# EAGLE board Dataforge-Pi (EAGLE 9.2.1), part 1 of 2
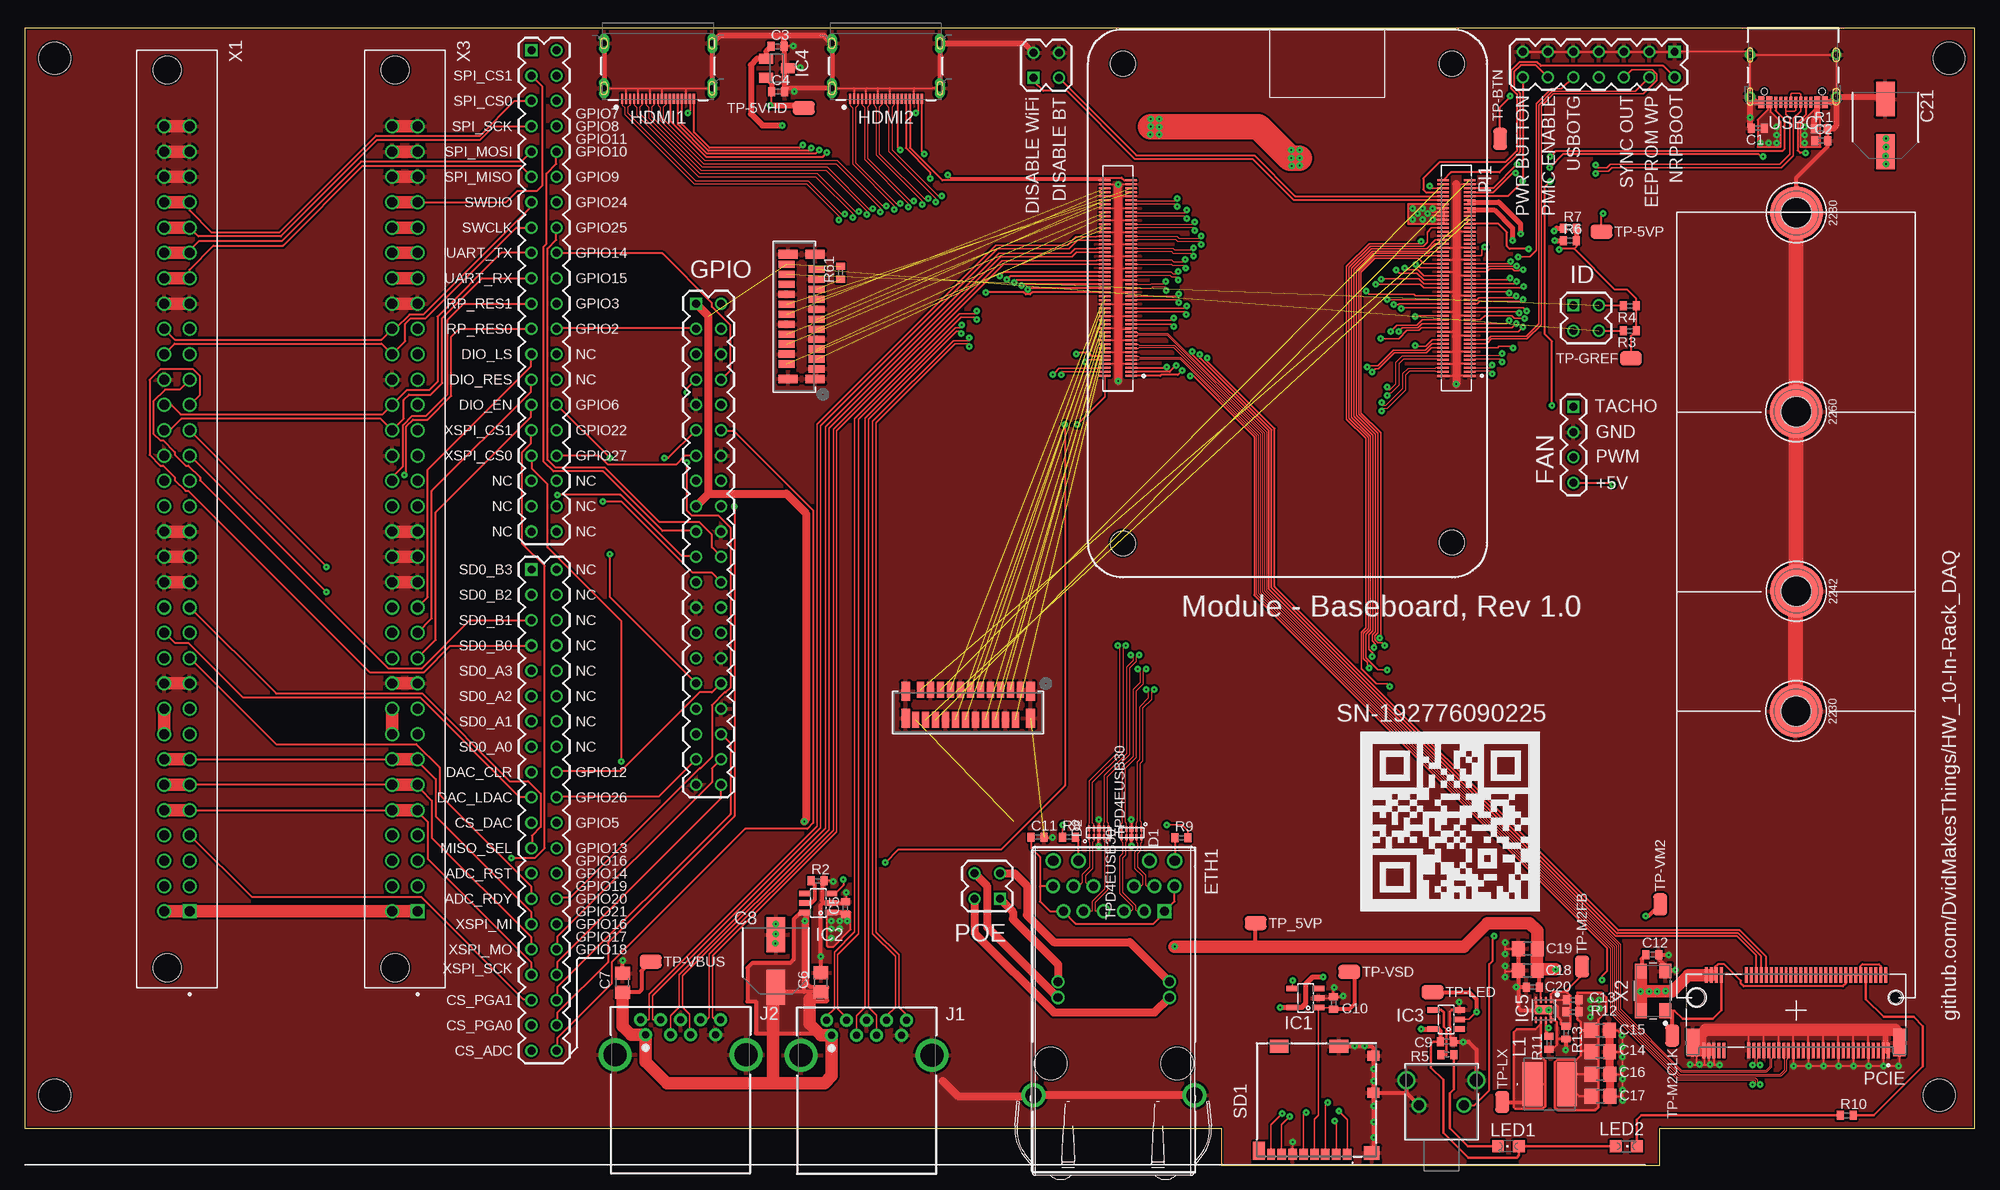
[diagram p5: board, top side]
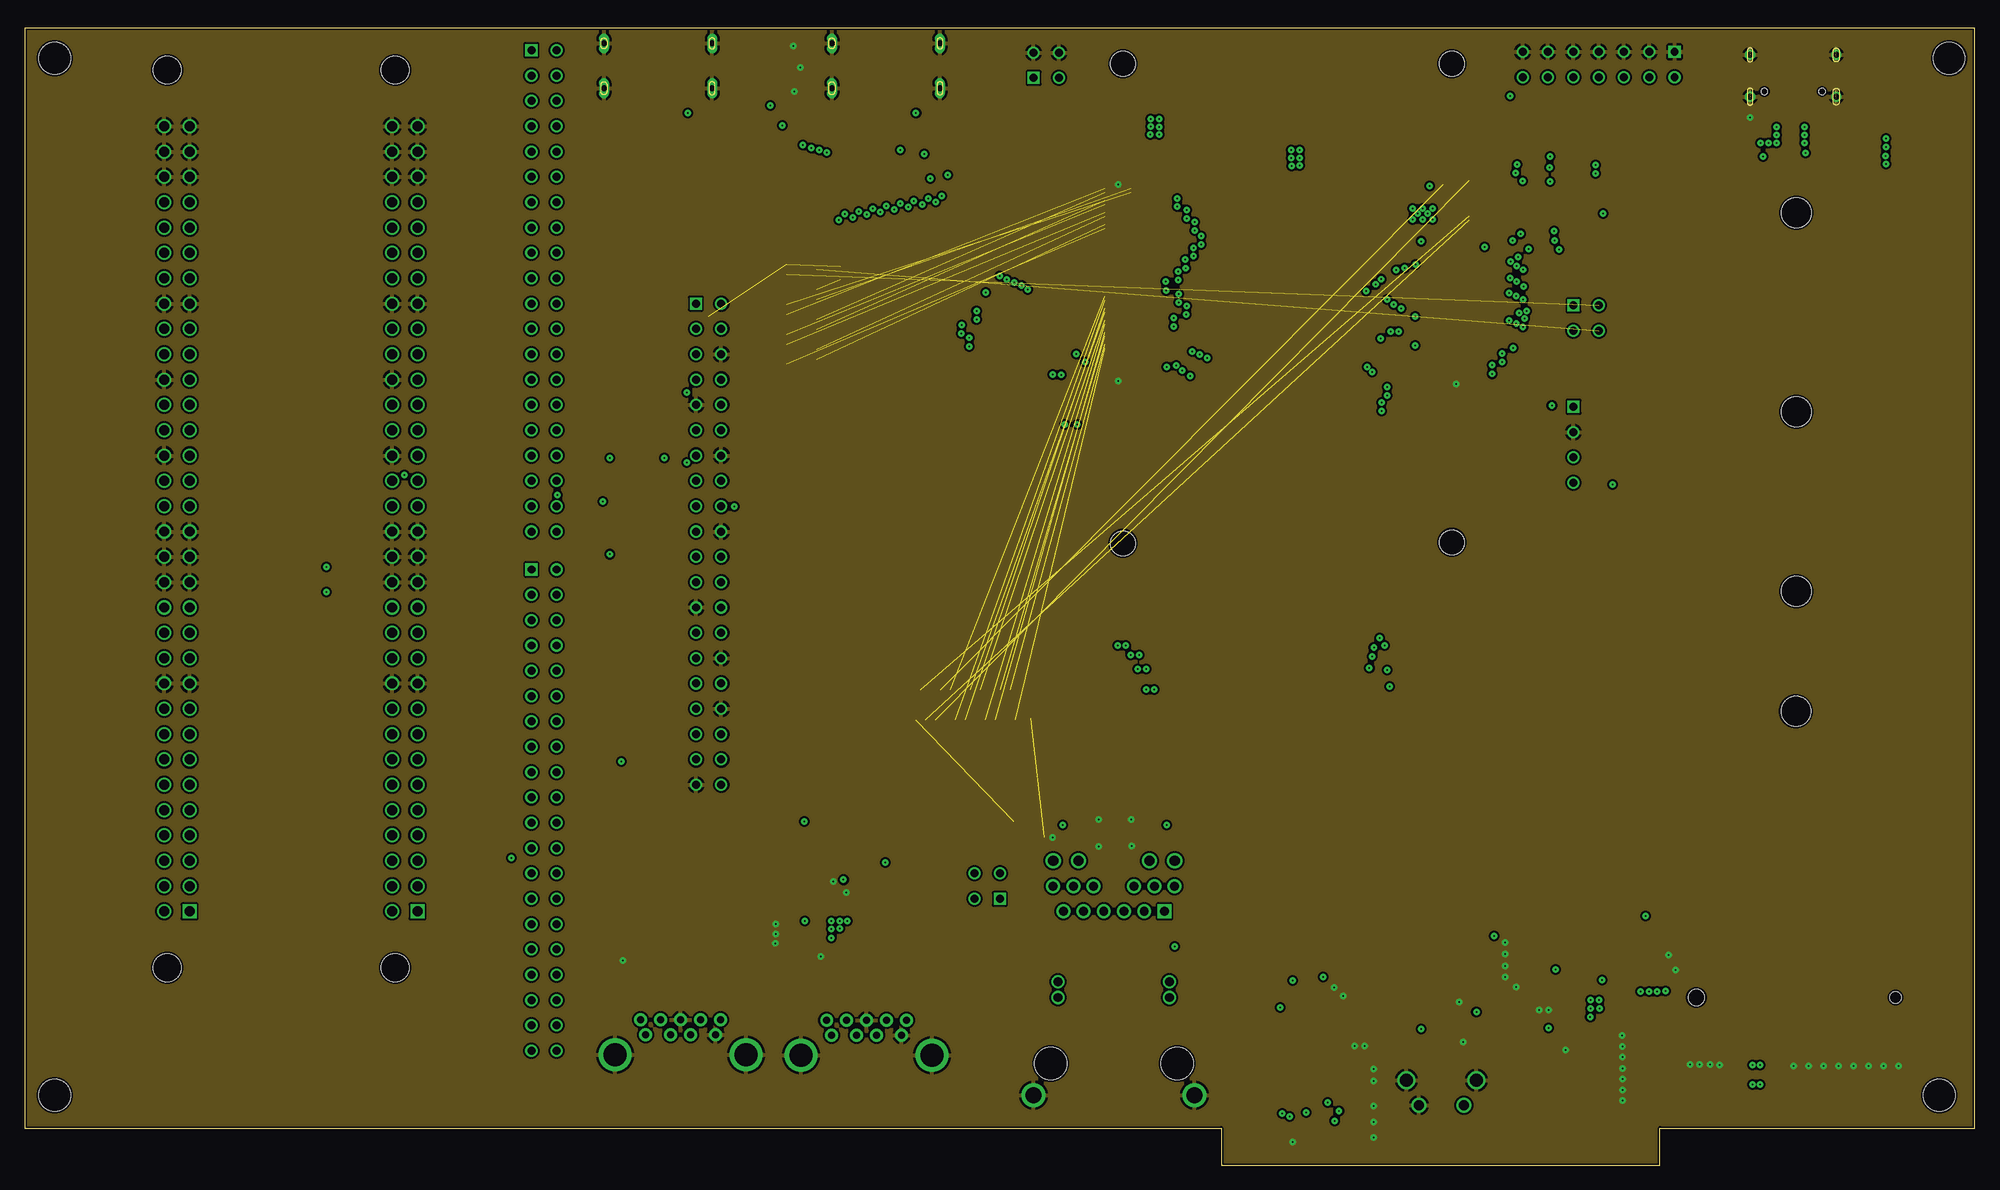
[diagram p6: board, inner layer Route2]
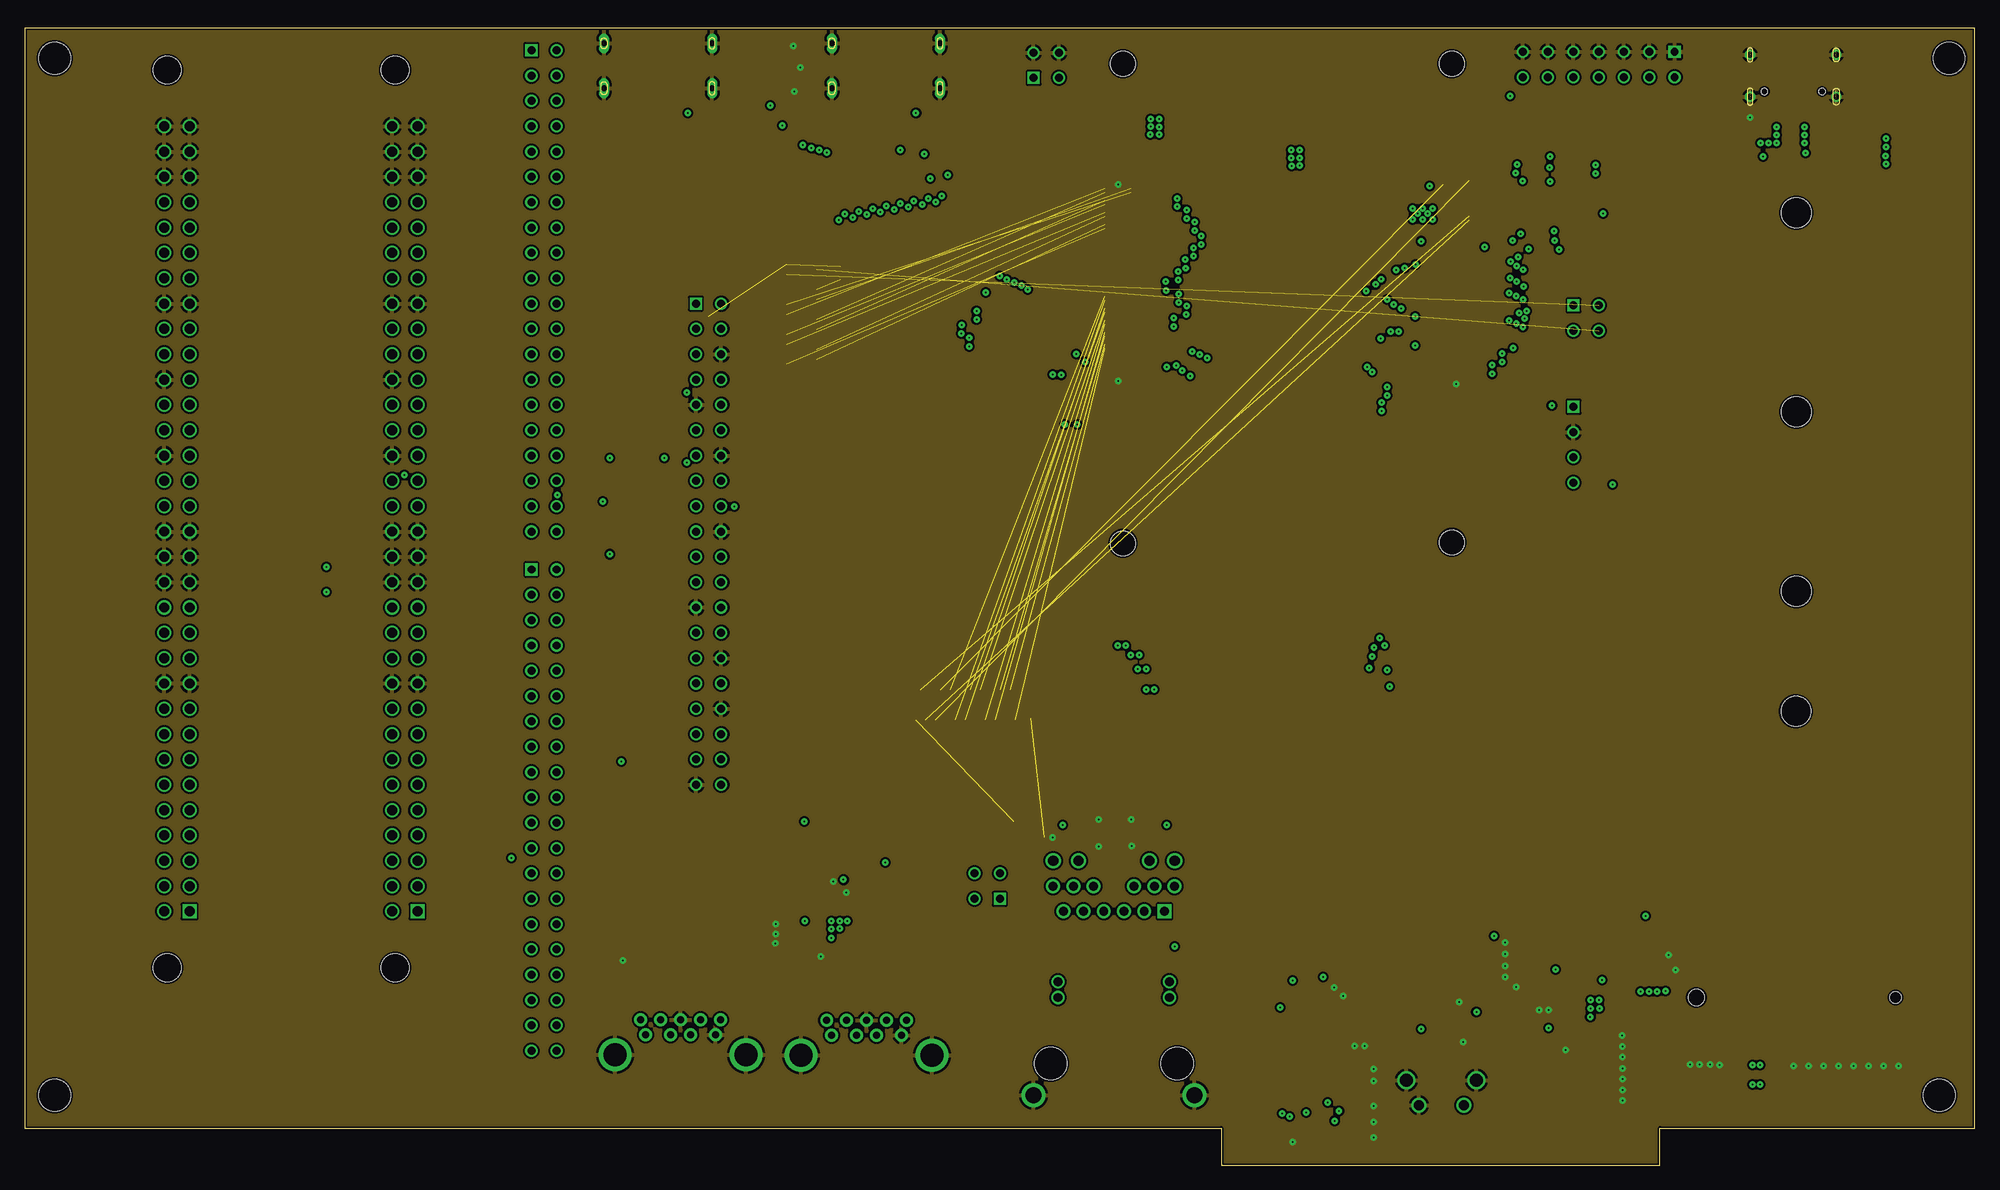
[diagram p7: board, inner layer Route15]
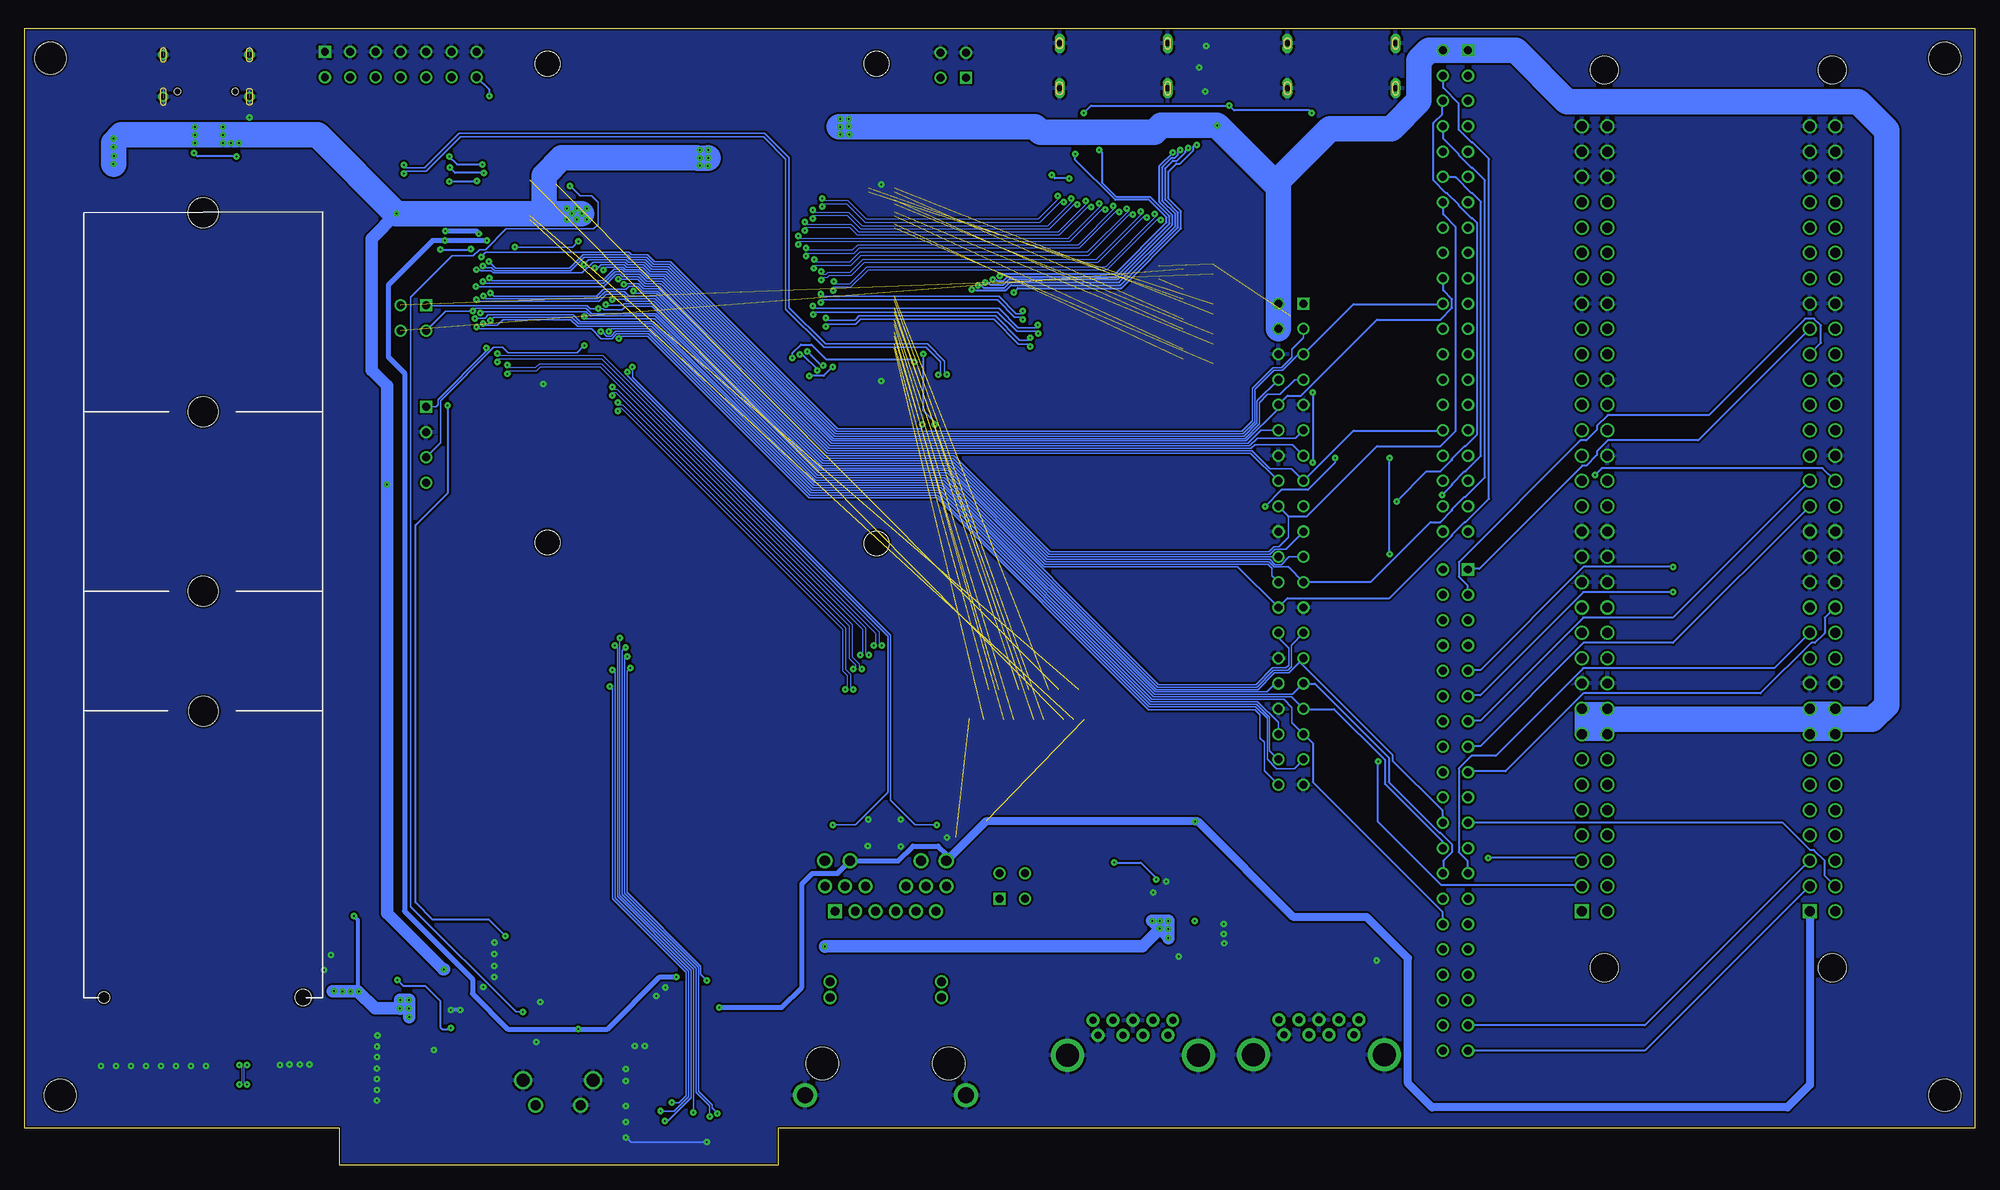
[diagram p8: board, bottom side, seen from below]

Size 195.56 x 114 mm. Coordinates in mm from the lower left corner, seen from the top.
Outline: 0,3.69 120,3.69 120,0 164,0 164,3.69 195.56,3.69 195.56,114 0,114 0,3.69
Copper layers (1+2*15+16): Top 0.035mm / dielectric 0.0994mm / Route2 0.0152mm / dielectric 1.265mm / Route15 0.0152mm / dielectric 0.0994mm / Bottom 0.035mm
Design rules "JLC04161H-3313": minimum track width 3.5mil, minimum drill 0.15mm, track to track 3.5mil, track to pad 3.5mil, pad to pad 3.5mil, via to via 3.5mil, smd to smd 3.5mil, copper to edge 0.2mm, drill to drill 6mil, minimum pad ring 8mil, minimum via ring 0.25mm, stop-mask expansion 0.05mm, vias tented up to drill 16mil, thermal gap 10mil
Net classes: 1 50R_DIFFPAIR: width 0.4 mm, drill 0.15 mm, clearance 0.191 mm; 2 90R_DIFFPAIR: width 0.155 mm, drill 0.15 mm, clearance 0.191 mm; 3 100R_DIFFPAIR: width 0.121 mm, drill 0.15 mm, clearance 0.191 mm
Holes 3.2 mm at 3,7 3,111 193,111 192,7

## Footprints (pad centres in the part's own frame; a part is rotated, then mirrored left to right if it is on the bottom)
WA-SMSI_9774010243 = smd 5.3 x 5.3: 1 0,0 | hole 3: 0,0
0402 = smd 0.7 x 0.9: 1 -0.65,0; 2 0.65,0
0805 = smd 1.3 x 1.5: 1 -0.95,0; 2 0.95,0
100UF-16V = smd 3.5 x 1.85: 1 -2.65,0; 2 2.65,0
2X20 = drill 0.8 square: 1 -1.27,24.13 | drill 0.8: 2 1.27,24.13; 3 -1.27,21.59; 4 1.27,21.59; 5 -1.27,19.05; 6 1.27,19.05; 7 -1.27,16.51; 8 1.27,16.51; 9 -1.27,13.97; 10 1.27,13.97; 11 -1.27,11.43; 12 1.27,11.43; 13 -1.27,8.89; 14 1.27,8.89; 15 -1.27,6.35; 16 1.27,6.35; 17 -1.27,3.81; 18 1.27,3.81; 19 -1.27,1.27; 20 1.27,1.27; 21 -1.27,-1.27; 22 1.27,-1.27; 23 -1.27,-3.81; 24 1.27,-3.81; 25 -1.27,-6.35; 26 1.27,-6.35; 27 -1.27,-8.89; 28 1.27,-8.89; 29 -1.27,-11.43; 30 1.27,-11.43; 31 -1.27,-13.97; 32 1.27,-13.97; 33 -1.27,-16.51; 34 1.27,-16.51; 35 -1.27,-19.05; 36 1.27,-19.05; 37 -1.27,-21.59; 38 1.27,-21.59; 39 -1.27,-24.13; 40 1.27,-24.13
USON = smd 0.57 x 0.2: 1 -0.4,1; 2 -0.4,0.5; 4 -0.4,-0.5; 5 -0.4,-1; 6 0.435,-1; 7 0.435,-0.5; 9 0.435,0.5; 10 0.435,1 | smd 0.57 x 0.4: 3 -0.4,0; 8 0.435,0
MAGJACK_POE = drill 1.02 pad 1.53: 17 6.11,15.24; 18 3.57,15.24; 19 -3.54,15.24; 20 -6.08,15.24 | drill 0.9 pad 1.4: CT1 -6.08,12.7; CT2 -5.07,10.16; CT4 6.1,12.7; TD1+ -4.05,12.7; TD1- -2.02,12.7; TD2+ -1.01,10.16; TD2- -3.04,10.16; TD3+ 1.02,10.16; TD3- 3.05,10.16; TD4+ 4.07,12.7; TD4- 2.04,12.7 | drill 0.9 pad 1.4 square: CT3 5.08,10.16 | drill 1.6 pad 2.4: MH3 -8.06,-8.25; MH4 8.08,-8.25 | drill 0.9 pad 1.25: VC1 5.6,3.1; VC2 -5.58,3.1; VC3 5.6,1.53; VC4 -5.58,1.53 | hole 3.25: -6.34,-5.08; 6.36,-5.08
1X4 = drill 0.8 square: 1 0,3.81 | drill 0.8: 2 0,1.27; 3 0,-1.27; 4 0,-3.81
685119136923 = smd 0.23 x 1: 1 3.6,1.05; 2 3.2,1.05; 3 2.8,1.05; 4 2.4,1.05; 5 2,1.05; 6 1.6,1.05; 7 1.2,1.05; 8 0.8,1.05; 9 0.4,1.05; 10 0,1.05; 11 -0.4,1.05; 12 -0.8,1.05; 13 -1.2,1.05; 14 -1.6,1.05; 15 -2,1.05; 16 -2.4,1.05; 17 -2.8,1.05; 18 -3.2,1.05; 19 -3.6,1.05 | drill 0.6 pad 0.9 long: S1 5.425,0; S2 -5.425,0 | drill 0.6 pad 0.8 long: S3 -5.425,-4.5; S4 5.425,-4.5
SOT23-5 = smd 0.55 x 1.2: 1 -0.95,-1.3; 2 0,-1.3; 3 0.95,-1.3; 4 0.95,1.3; 5 -0.95,1.3
SOT23-6 = smd 0.55 x 1.2: 1 -0.95,-1.3; 2 0,-1.3; 3 0.95,-1.3; 4 0.95,1.3; 5 0,1.3; 6 -0.95,1.3
SOT23 = smd 1 x 1.4: 1 -0.95,-1.1; 2 0.95,-1.1; 3 0,1.1
SON50P201X201X56-9T90X170N = smd 0.715 x 0.27: 1 -1.001,0.75; 2 -1.001,0.25; 3 -1.001,-0.25; 4 -1.001,-0.75; 5 1.001,-0.75; 6 1.001,-0.25; 7 1.001,0.25; 8 1.001,0.75 | smd 0.9 x 1.7: 9 0,0
2X2 = drill 0.8 square: 1 -1.27,1.27 | drill 0.8: 2 1.27,1.27; 3 -1.27,-1.27; 4 1.27,-1.27
692121030100 = drill 0.7 pad 1.3: 1 -3.5,5.36; 2 -1,5.36; 3 1,5.36; 4 3.5,5.36; 5 4,6.86; 6 2,6.86; 7 0,6.86; 8 -2,6.86; 9 -4,6.86 | drill 2.3 pad 3.3: S1 -6.57,3.36; S2 6.57,3.36
FH12-22S-0.5SH = smd 0.711 x 1.6: 1 5.251,2.244; 2 4.751,-0.756; 3 4.251,2.244; 4 3.751,-0.756; 5 3.251,2.244; 6 2.751,-0.756; 7 2.251,2.244; 8 1.75,-0.756; 9 1.25,2.244; 10 0.75,-0.756; 11 0.25,2.244; 12 -0.25,-0.756; 13 -0.75,2.244; 14 -1.25,-0.756; 15 -1.75,2.244; 16 -2.251,-0.756; 17 -2.751,2.244; 18 -3.251,-0.756; 19 -3.751,2.244; 20 -4.251,-0.756; 21 -4.751,2.244; 22 -5.251,-0.756 | smd 0.889 x 1.905: 23 -6.25,2.091; 24 6.25,2.091; 25 -6.25,-0.604; 26 6.25,-0.604
2X7 = drill 0.8 square: 1 -1.27,7.62 | drill 0.8: 2 1.27,7.62; 3 -1.27,5.08; 4 1.27,5.08; 5 -1.27,2.54; 6 1.27,2.54; 7 -1.27,0; 8 1.27,0; 9 -1.27,-2.54; 10 1.27,-2.54; 11 -1.27,-5.08; 12 1.27,-5.08; 13 -1.27,-7.62; 14 1.27,-7.62
SRR5228A = smd 4.4 x 2: 1 0,1.75; 2 0,-1.75
CHIPLED_0805 = smd 1.2 x 1.2: A 0,-1.05; C 0,1.05
M.2 = smd 0.3 x 1.55: 1 9.25,-4.005; 2 9,3.545; 3 8.75,-4.005; 4 8.5,3.545; 5 8.25,-4.005; 6 8,3.545; 7 7.75,-4.005; 8 7.5,3.545; 9 7.25,-4.005; 10 7,3.545; 11 6.75,-4.005; 12 6.5,3.545; 13 6.25,-4.005; 14 6,3.545; 15 5.75,-4.005; 16 5.5,3.545; 17 5.25,-4.005; 18 5,3.545; 19 4.75,-4.005; 20 4.5,3.545; 21 4.25,-4.005; 22 4,3.545; 23 3.75,-4.005; 24 3.5,3.545; 25 3.25,-4.005; 26 3,3.545; 27 2.75,-4.005; 28 2.5,3.545; 29 2.25,-4.005; 30 2,3.545; 31 1.75,-4.005; 32 1.5,3.545; 33 1.25,-4.005; 34 1,3.545; 35 0.75,-4.005; 36 0.5,3.545; 37 0.25,-4.005; 38 0,3.545; 39 -0.25,-4.005; 40 -0.5,3.545; 41 -0.75,-4.005; 42 -1,3.545; 43 -1.25,-4.005; 44 -1.5,3.545; 45 -1.75,-4.005; 46 -2,3.545; 47 -2.25,-4.005; 48 -2.5,3.545; 49 -2.75,-4.005; 50 -3,3.545; 51 -3.25,-4.005; 52 -3.5,3.545; 53 -3.75,-4.005; 54 -4,3.545; 55 -4.25,-4.005; 56 -4.5,3.545; 57 -4.75,-4.005; 58 -5,3.545; 67 -7.25,-4.005; 68 -7.5,3.545; 69 -7.75,-4.005; 70 -8,3.545; 71 -8.25,-4.005; 72 -8.5,3.545; 73 -8.75,-4.005; 74 -9,3.545; 75 -9.25,-4.005 | smd 1.2 x 2.75: S1 10.35,-3.23; S2 -10.35,-3.23 | hole 1.15: 10,1.27 | hole 1.65: -10,1.27
CM5 = smd 1.14 x 0.2: 1 17.9,-7.22; 2 15.26,-7.22; 3 17.9,-6.82; 4 15.26,-6.82; 5 17.9,-6.42; 6 15.26,-6.42; 7 17.9,-6.02; 8 15.26,-6.02; 9 17.9,-5.62; 10 15.26,-5.62; 11 17.9,-5.22; 12 15.26,-5.22; 13 17.9,-4.82; 14 15.26,-4.82; 15 17.9,-4.42; 16 15.26,-4.42; 17 17.9,-4.02; 18 15.26,-4.02; 19 17.9,-3.62; 20 15.26,-3.62; 21 17.9,-3.22; 22 15.26,-3.22; 23 17.9,-2.82; 24 15.26,-2.82; 25 17.9,-2.42; 26 15.26,-2.42; 27 17.9,-2.02; 28 15.26,-2.02; 29 17.9,-1.62; 30 15.26,-1.62; 31 17.9,-1.22; 32 15.26,-1.22; 33 17.9,-0.82; 34 15.26,-0.82; 35 17.9,-0.42; 36 15.26,-0.42; 37 17.9,-0.02; 38 15.26,-0.02; 39 17.9,0.38; 40 15.26,0.38; 41 17.9,0.78; 42 15.26,0.78; 43 17.9,1.18; 44 15.26,1.18; 45 17.9,1.58; 46 15.26,1.58; 47 17.9,1.98; 48 15.26,1.98; 49 17.9,2.38; 50 15.26,2.38; 51 17.9,2.78; 52 15.26,2.78; 53 17.9,3.18; 54 15.26,3.18; 55 17.9,3.58; 56 15.26,3.58; 57 17.9,3.98; 58 15.26,3.98; 59 17.9,4.38; 60 15.26,4.38; 61 17.9,4.78; 62 15.26,4.78; 63 17.9,5.18; 64 15.26,5.18; 65 17.9,5.58; 66 15.26,5.58; 67 17.9,5.98; 68 15.26,5.98; 69 17.9,6.38; 70 15.26,6.38; 71 17.9,6.78; 72 15.26,6.78; 73 17.9,7.18; 74 15.26,7.18; 75 17.9,7.58; 76 15.26,7.58; 77 17.9,7.98; 78 15.26,7.98; 79 17.9,8.38; 80 15.26,8.38; 81 17.9,8.78; 82 15.26,8.78; 83 17.9,9.18; 84 15.26,9.18; 85 17.9,9.58; 86 15.26,9.58; 87 17.9,9.98; 88 15.26,9.98; 89 17.9,10.38; 90 15.26,10.38; 91 17.9,10.78; 92 15.26,10.78; 93 17.9,11.18; 94 15.26,11.18; 95 17.9,11.58; 96 15.26,11.58; 97 17.9,11.98; 98 15.26,11.98; 99 17.9,12.38; 100 15.26,12.38; 101 -16.041,-7.26; 102 -18.681,-7.26; 103 -16.041,-6.86; 104 -18.681,-6.86; 105 -16.041,-6.46; 106 -18.681,-6.46; 107 -16.041,-6.06; 108 -18.681,-6.06; 109 -16.041,-5.66; 110 -18.681,-5.66; 111 -16.041,-5.26; 112 -18.681,-5.26; 113 -16.041,-4.86; 114 -18.681,-4.86; 115 -16.041,-4.46; 116 -18.681,-4.46; 117 -16.041,-4.06; 118 -18.681,-4.06; 119 -16.041,-3.66; 120 -18.681,-3.66; 121 -16.041,-3.26; 122 -18.681,-3.26; 123 -16.041,-2.86; 124 -18.681,-2.86; 125 -16.041,-2.46; 126 -18.681,-2.46; 127 -16.041,-2.06; 128 -18.681,-2.06; 129 -16.041,-1.66; 130 -18.681,-1.66; 131 -16.041,-1.26; 132 -18.681,-1.26; 133 -16.041,-0.86; 134 -18.681,-0.86; 135 -16.041,-0.46; 136 -18.681,-0.46; 137 -16.041,-0.06; 138 -18.681,-0.06; 139 -16.041,0.34; 140 -18.681,0.34; 141 -16.041,0.74; 142 -18.681,0.74; 143 -16.041,1.14; 144 -18.681,1.14; 145 -16.041,1.54; 146 -18.681,1.54; 147 -16.041,1.94; 148 -18.681,1.94; 149 -16.041,2.34; 150 -18.681,2.34; 151 -16.041,2.74; 152 -18.681,2.74; 153 -16.041,3.14; 154 -18.681,3.14; 155 -16.041,3.54; 156 -18.681,3.54; 157 -16.041,3.94; 158 -18.681,3.94; 159 -16.041,4.34; 160 -18.681,4.34; 161 -16.041,4.74; 162 -18.681,4.74; 163 -16.041,5.14; 164 -18.681,5.14; 165 -16.041,5.54; 166 -18.681,5.54; 167 -16.041,5.94; 168 -18.681,5.94; 169 -16.041,6.34; 170 -18.681,6.34; 171 -16.041,6.74; 172 -18.681,6.74; 173 -16.041,7.14; 174 -18.681,7.14; 175 -16.041,7.54; 176 -18.681,7.54; 177 -16.041,7.94; 178 -18.681,7.94; 179 -16.041,8.34; 180 -18.681,8.34; 181 -16.041,8.74; 182 -18.681,8.74; 183 -16.041,9.14; 184 -18.681,9.14; 185 -16.041,9.54; 186 -18.681,9.54; 187 -16.041,9.94; 188 -18.681,9.94; 189 -16.041,10.34; 190 -18.681,10.34; 191 -16.041,10.74; 192 -18.681,10.74; 193 -16.041,11.14; 194 -18.681,11.14; 195 -16.041,11.54; 196 -18.681,11.54; 197 -16.041,11.94; 198 -18.681,11.94; 199 -16.041,12.34; 200 -18.681,12.34 | hole 2.5: -16.86,24.04; 16.14,24.04; -16.86,-24.06; 16.14,-23.96
MICROSD = smd 0.85 x 1.1: CLK -1.295,-5.294; CMD 0.905,-5.294; DAT0 -3.495,-5.294; DAT2 3.105,-5.294; DAT3/CD 2.005,-5.294; VDD -0.195,-5.294; VSS -2.395,-5.294 | smd 0.75 x 1.1: DAT1 -4.545,-5.294 | smd 1.17 x 1.8: DET1 -5.755,-4.944 | smd 1.9 x 1.35: DET2 -3.73,5.531; MT1 2.24,5.531 | smd 1.2 x 1: MT2 5.74,4.556; MT3 5.74,0.856 | smd 1.55 x 1.35: MT4 5.565,-5.169
SW2_1825027-C_TEC = drill 0.991 pad 1.499: 1 0,0; 2 4.496,0 | drill 1.295 pad 1.803: 3 -1.245,2.489; 4 5.766,2.489
TP = smd 2.2 x 1.4: TP 0,0
629722000214 = smd 0.3 x 1.15: A1 -3.35,4.745; A4 -2.55,4.745; A5 -1.25,4.745; A6 -0.25,4.745; A7 0.25,4.745; A8 1.25,4.745; A9 2.55,4.745; A12 3.35,4.745; B1 3.05,4.745; B4 2.25,4.745; B5 1.75,4.745; B6 0.75,4.745; B7 -0.75,4.745; B8 -1.75,4.745; B9 -2.25,4.745; B12 -3.05,4.745 | drill 0.6 pad 1: S1 -4.32,4.18; S2 4.32,4.18; S3 -4.32,0; S4 4.32,0 | hole 0.65: -2.89,3.68; 2.89,3.68
CON-VG-MAB64-RECEPTACLE = drill 1 pad 1.35 square: A1 39.37,1.27 | drill 1 pad 1.35: A2 36.83,1.27; A3 34.29,1.27; A4 31.75,1.27; A5 29.21,1.27; A6 26.67,1.27; A7 24.13,1.27; A8 21.59,1.27; A9 19.05,1.27; A10 16.51,1.27; A11 13.97,1.27; A12 11.43,1.27; A13 8.89,1.27; A14 6.35,1.27; A15 3.81,1.27; A16 1.27,1.27; A17 -1.27,1.27; A18 -3.81,1.27; A19 -6.35,1.27; A20 -8.89,1.27; A21 -11.43,1.27; A22 -13.97,1.27; A23 -16.51,1.27; A24 -19.05,1.27; A25 -21.59,1.27; A26 -24.13,1.27; A27 -26.67,1.27; A28 -29.21,1.27; A29 -31.75,1.27; A30 -34.29,1.27; A31 -36.83,1.27; A32 -39.37,1.27; B1 39.37,-1.27; B2 36.83,-1.27; B3 34.29,-1.27; B4 31.75,-1.27; B5 29.21,-1.27; B6 26.67,-1.27; B7 24.13,-1.27; B8 21.59,-1.27; B9 19.05,-1.27; B10 16.51,-1.27; B11 13.97,-1.27; B12 11.43,-1.27; B13 8.89,-1.27; B14 6.35,-1.27; B15 3.81,-1.27; B16 1.27,-1.27; B17 -1.27,-1.27; B18 -3.81,-1.27; B19 -6.35,-1.27; B20 -8.89,-1.27; B21 -11.43,-1.27; B22 -13.97,-1.27; B23 -16.51,-1.27; B24 -19.05,-1.27; B25 -21.59,-1.27; B26 -24.13,-1.27; B27 -26.67,-1.27; B28 -29.21,-1.27; B29 -31.75,-1.27; B30 -34.29,-1.27; B31 -36.83,-1.27; B32 -39.37,-1.27 | hole 2.79: -45.01,-0.97; 45.01,-0.97
OSCCC500X320X130 = smd 1.487 x 1.187: 1 -1.988,-1.238; 2 1.988,-1.238; 3 1.988,1.238; 4 -1.988,1.238

## Placement (x,y rotation side)
2230  M2 x 1mm  [WA-SMSI_9774010243]  177.65,45.52 270 top
2242  M2 x 1mm  [WA-SMSI_9774010243]  177.69,57.56 270 top
2260  M2 x 1mm  [WA-SMSI_9774010243]  177.66,75.55 270 top
2280  M2 x 1mm  [WA-SMSI_9774010243]  177.69,95.48 270 top
C1  [0402]  173.82,103.97 180 top
C2  [0402]  180.17,102.73 0 top
C3  100nF  [0402]  75.48,112.18 0 top
C4  100nF  [0402]  75.55,107.65 0 top
C5  100nF  [0402]  82.31,25.75 90 top
C6  10uF  [0805]  79.83,18.32 90 top
C7  10uF  [0805]  59.94,18.3 90 top
C8  100uF 16V  [100UF-16V]  75.33,20.46 90 top
C9  100nF  [0402]  142.63,12.37 0 top
C10  100nF  [0402]  131.27,16.25 90 top
C11  100nF  [0402]  101.57,32.89 0 top
C12  100nF  [0402]  163.24,21.09 0 top
C13  4.7nF  [0402]  155.24,16.57 180 top
C14  10uF  [0805]  158,11.37 0 top
C15  10uF  [0805]  157.99,13.5 0 top
C16  10uF  [0805]  158.02,9.12 0 top
C17  10uF  [0805]  158.03,6.9 0 top
C18  10uF  [0805]  150.73,19.51 180 top
C19  10uF  [0805]  150.74,21.7 180 top
C20  100nF  [0402]  151.24,17.85 180 top
C21  100uF 16V  [100UF-16V]  186.62,104.25 90 top
CON2  [2X20]  52.07,35.59 0 top
CON3  [2X20]  52.07,87.66 0 top
D1  TPD4EUSB30  [USON]  110.99,33.31 270 top
D2  TPD4EUSB30  [USON]  107.71,33.31 90 top
ETH1  G16LX-188S7-1G-GO-Y  [MAGJACK_POE]  109.22,15.27 0 top
FAN  [1X4]  155.33,72.23 0 top
GPIO  [2X20]  68.58,62.26 0 top
HDMI1  685119136923  [685119136923]  63.5,107.98 180 top
HDMI2  685119136923  [685119136923]  86.36,107.98 180 top
IC1  RT9742GGJ  [SOT23-5]  128.46,16.74 90 top
IC2  AP22653W6  [SOT23-6]  79.57,26.27 90 top
IC3  74LVC1G07  [SOT23-5]  142.56,14.61 90 top
IC4  RT9742NGV  [SOT23]  75.42,109.99 270 top
IC5  AP3441SHE-7B  [SON50P201X201X56-9T90X170N]  152.33,15.55 270 top
ID  [2X2]  156.6,84.93 0 top
J1  692121030100  [692121030100]  84.43,7.64 0 top
J2  692121030100  [692121030100]  65.77,7.7 0 top
J3  FH12-22S-0.5SVA  [FH12-22S-0.5SH]  94.6,45.4 0 top
J4  FH12-22S-0.5SVA  [FH12-22S-0.5SH]  77.17,85.08 270 top
JP2  [2X7]  157.85,110.36 270 top
JP3  [2X2]  102.44,110.29 90 top
L1  L  [SRR5228A]  152.94,8.12 90 top
LED1  Green  [CHIPLED_0805]  148.82,1.89 90 top
LED2  [CHIPLED_0805]  160.62,1.88 270 top
PCIE  M.2  [M.2]  177.65,15.51 0 top
PI1  [CM5]  127,86.39 0 top
POE  POE  [2X2]  96.52,27.97 180 top
R1  2.2K 1%  [0402]  180.15,103.94 0 top
R2  15K 1%  [0402]  79.52,28.51 0 top
R3  2.2K 1%  [0402]  160.96,83.65 180 top
R4  2.2K 1%  [0402]  160.97,86.15 180 top
R5  1K  [0402]  142.66,11.07 180 top
R6  0R  [0402]  154.98,92.71 0 top
R7  DNI  [0402]  154.97,93.95 0 top
R8  470R  [0402]  104.71,32.89 0 top
R9  470R  [0402]  115.99,32.82 0 top
R10  [0402]  182.73,4.97 0 top
R11  100K 1%  [0402]  152.86,12.28 270 top
R12  10K 1%  [0402]  155.23,15.36 180 top
R13  2.2K 1%  [0402]  154.57,13.29 270 top
R61  2.2K 1%  [0402]  81.81,89.46 90 top
SD1  [MICROSD]  129.54,6.38 0 top
SW1  1825027-8  [SW2_1825027-C_TEC]  139.83,6.01 0 top
TP-5VHD  TP  [TP]  78.12,106 180 top
TP-5VP  TP  [TP]  158.13,93.6 0 top
TP-BTN  TP  [TP]  147.97,102.9 90 top
TP-GREF  TP  [TP]  161.08,80.9 180 top
TP-LED  TP  [TP]  141.18,17.35 0 top
TP-LX  TP  [TP]  148.19,6.32 90 top
TP-M2CLK  TP  [TP]  165.24,12.98 270 top
TP-M2FB  TP  [TP]  156.17,19.91 90 top
TP-VBUS  TP  [TP]  62.76,20.39 0 top
TP-VM2  TP  [TP]  164.02,26.14 90 top
TP-VSD  TP  [TP]  132.83,19.37 0 top
TP_5VP  TP  [TP]  123.45,24.25 0 top
USBC  629722000214  [629722000214]  177.36,111.32 180 top
X1  CON-VG_MAB642  [CON-VG-MAB64-RECEPTACLE]  15.24,64.8 270 top
X2  CRYSTAL  [OSCCC500X320X130]  163.32,17.47 90 top
X3  CON-VG_MAB642  [CON-VG-MAB64-RECEPTACLE]  38.1,64.8 270 top

## Tracks (layer width: path | path; a pad name or v marks a point on that pad's centre or on a via)
!ADC_RST
  Bottom 0.2: CON2.25 50.86,29.33 50.86,30.5 51.74,31.38 51.74,39.77 50.47,41.04 48.03,41.04 39.24,49.83 20.11,49.83 16.6,53.34 X1.A12
+1V8  (via drill 0.15)
  Top 0.2: PI1.87 144.9,96.57 PI1.89
  Top 0.508: 144.9,96.57 147.83,96.57 150.02,94.38 v150.02,93.39 | v153.38,93.69 153.65,93.95 R7.1
  Bottom 0.508: v153.38,93.69 150.32,93.69 v150.02,93.39
+3V3  (via drill 0.15)  (3 unrouted)
  Top 0.2: PI1.83 144.9,95.79 PI1.85
  Top 0.254: LED2.A LED1.A 149.87,0.99 149.63,0.75 144.78,0.75 142.27,3.26 142.27,8.55 141.04,9.78 141.04,12.12 141.29,12.37 C9.1
  Top 0.406: IC3.5 141.77,13.66 141.98,13.45 C9.1
  Top 0.508: 144.9,95.79 147.39,95.79 149.22,93.96 149.22,92.71 v149.24,92.69 | v153.43,92.69 154.31,92.69 R6.1 | v140.04,13.64 141.24,13.64 IC3.5 | v130.21,18.85 129.15,18.85 128.45,18.15 128.45,16.27 128.49,16.23 128.05,15.79 IC1.5 125.92,15.79 v125.9,15.81
  Top 0.813: GPIO.17 68.57,67.33 | GPIO.1 68.57,85.13 68.57,67.33 | 68.57,67.33 76.38,67.33 78.35,65.36 78.35,34.65 v78.17,34.47
  Top 1.27: X3.A1 X3.B1 X1.A1 X1.B1
  Bottom 0.508: v149.24,92.69 v153.43,92.69 154.68,92.69 159.12,88.25 159.12,81.05 157.48,79.41 157.48,25.46 150.67,18.65 150.67,17.19 147.12,13.64 v140.04,13.64 137.13,13.64 131.89,18.88 130.35,18.88 130.32,18.85 v130.21,18.85 | v125.9,15.81 119.65,15.81 117.63,17.83 117.63,28.2 116.58,29.25 114.05,29.25 ETH1.18 107.97,30.51 106.5,31.98 103.95,31.98 103.14,31.17 ETH1.20
  Bottom 0.813: ETH1.20 99.18,34.47 v78.17,34.47 77.9,34.47 68.3,24.87 60.96,24.87 56.84,20.75 56.84,8.19 54.42,5.77 18.78,5.77 16.51,8.04 X1.A1
+5V  (via drill 0.15)
  Top 0.2: PI1.86 PI1.88 138.74,96.37 138.74,94.37 PI1.78 PI1.80 | PI1.86 PI1.84 | PI1.84 PI1.82 | PI1.82 PI1.80 | PI1.86 141.2,95.97 v141.2,95.9 141.2,95.57 PI1.84 | PI1.82 141.2,95.17 v141.2,94.8 141.2,94.77 PI1.80 | IC5.3 152.08,17.66 C20.1 | TP-5VP.TP 158.13,95.23 v158.3,95.4 | v186.65,101.2 186.66,101.18 C21.1 | v127.07,100.18 127.11,100.2 127.11,100.98 | 81.61,25.44 81.61,25.32 | v127.86,100.22 127.89,100.2 v127.84,100.98 127.89,101.77 v127.85,101.79 | v127.03,101.78 127.01,101.77 127.01,100.98 | v112.89,103.36 112.95,103.33 112.95,104.13 112.95,104.89 v112.93,104.9 | v113.77,103.35 113.83,103.33 113.83,104.11 | 113.83,104.11 v113.78,104.11 | 113.83,104.11 113.83,104.13 113.83,104.89 v113.79,104.91 | 174.8,106.6 174.8,105.8 173.8,104.8 173.8,102.1 176.1,102.1 176.1,104.6 175.1,105.6 175.1,106.6 174.8,106.6 | 179.6,106.7 179.6,105.9 178.1,104.4 178.1,102.1 180.1,102.1 180.1,105.2 179.9,105.4 179.9,106.7 179.6,106.7
  Top 0.203: USBC.A9 USBC.B4 | USBC.B9 179.77,106.58 USBC.A4
  Top 0.221: 80.42,25.25 80.42,22 80.52,21.9 81.09,21.9 82.82,23.63 82.82,25.33 82.71,25.44 81.61,25.44 80.5,25.44 | FAN.4 159.07,68.42 v159.25,68.24
  Top 0.406: C20.1 151.89,19.3 C18.1 151.69,19.65 151.69,21.51 C19.1 | 81.08,25.32 IC2.1 | TP_5VP.TP 123.4,24.2 123.4,21.9
  Top 0.508: C3.1 74.32,111.67 IC4.1 | C5.1 82.09,25.32 81.61,25.32 81.08,25.32
  Top 0.61: R1.1 179.5,104.9 179.77,105.17 179.77,106.58 | IC4.1 73.45,110.94 72.82,110.31 72.82,105.41 73.98,104.25 v75.98,104.25 | v186.67,100.37 186.67,101.09 186.62,101.14 C21.1 186.62,102.03 v186.67,102.08
  Top 1.27: v153.53,19.61 151.73,19.61 151.69,19.65 | C18.1 151.68,21.5 151.69,21.51 | v115.32,21.9 123.4,21.9 144.34,21.9 146.71,24.27 150.91,24.27 151.69,23.49 C19.1 | X1.B9 X1.B8 | X3.B9 X3.B8
  Top 2.54: v127.84,100.98 127.11,100.98 127.01,100.98 126.88,100.98 123.73,104.13 113.83,104.13 112.95,104.13 v112.91,104.13
  Bottom 0.2: v178.5,104.1 178.56,104.11 178.56,103.3 | v186.67,102.93 186.66,102.94 185.89,103.3 | v175.7,103.3 175.72,103.33 175.72,103.3 | X1.B9 13.96,45.73 13.96,44.68
  Bottom 1.27: v158.3,95.4 160.79,92.91 160.79,79.69 159.25,78.15 v159.25,68.24 159.25,25.24 153.62,19.61 v153.53,19.61 | v80.88,23.66 v80.87,23.67 v80.87,24.48 v81.72,24.48 v81.73,24.49 v82.51,24.49 80.86,22.84 v80.86,22.75 80.86,23.64 v80.88,23.66 | v80.88,23.66 81.68,23.66 v81.72,23.7 83.49,21.93 115.29,21.93 v115.32,21.9
  Bottom 1.4: 38.67,44.64 38.67,45.05 X3.A9 | X3.A9 X3.B9 | X3.B8 X3.A8 X3.A9 | X1.B9 X1.A9 | X1.B8 X1.A8
  Bottom 2.54: v139.7,95.4 144.12,95.4 | 144.12,95.4 v158.3,95.4 166.2,103.3 v175.7,103.3 175.72,103.3 v178.5,103.3 178.56,103.3 179.1,103.3 185.89,103.3 186.67,102.52 v186.67,100.37 | 144.12,95.4 143.5,96.02 143.5,99.23 141.73,101 128.12,101 128.1,100.98 v127.84,100.98 v127.04,100.98 v127.03,100.99 | 69.85,98.12 GPIO.2 GPIO.4 | 69.85,98.12 v75.98,104.25 81.59,104.25 82.28,103.56 93.68,103.56 94.25,104.13 v112.91,104.13 113.9,104.13 | 69.85,98.12 69.85,98.69 69.6,98.94 69.6,98.99 64.65,103.94 58.5,103.94 55.72,106.72 55.72,110.79 54.72,111.79 CON3.2 CON3.1 46.02,111.79 40.88,106.65 11.66,106.65 8.8,103.79 8.8,46.12 10.24,44.68 13.96,44.68 38.63,44.68 38.67,44.64
  other vias: 139.2,95.9 139.2,94.8 140.2,94.8 140.2,95.9 140.7,95.4 178.5,102.5 175.7,102.5 175.7,104.1 174.1,102.5 174.9,102.5
  pour Top (isolate 0.203, no thermals): 138.74,96.37 138.74,94.37 142.61,94.37 142.61,96.37
  pour Top (isolate 0.203, no thermals): 174.8,105.8 173.8,104.8 173.8,102.1 176.1,102.1 176.1,104.6 175.1,105.6 175.1,106.7 174.8,106.7
  pour Top (isolate 0.203, no thermals): 178.2,102.1 180.1,102.1 180.1,105.4 180,105.5 179.9,105.6 179.9,106.9 179.6,106.9 179.6,105.9 178.3,104.6 178.1,104.4 178.1,102.1
  pour Top (isolate 0.203, no thermals): 80.57,25.1 80.57,25.15 80.71,25.29 82.61,25.29 82.73,25.17 82.73,23.61 81.14,22.02 80.62,22.02 80.53,22.11 80.53,24.99
ADC_RDY
  Top 0.2: CON2.27 50.77,26.79 50.77,27.96 41.59,37.14 41.59,39.87 39.24,42.21 25.19,42.21 16.6,50.8 X1.A11
BT_NDIS
  Top 0.2: JP3.3 111.49,101.24 123.32,101.24 127.39,97.17 PI1.92
CAM_GPIO0  (1 unrouted)
CAM_GPIO1  (1 unrouted)
CC1  (via drill 0.15)
  Top 0.2: USBC.A5 178.61,105.32 177.81,104.52 177.81,101.76 178.07,101.5 v178.62,101.5 | PI1.93 147.3,97.57 149.23,99.5 v149.53,99.5 | v152.95,100.02 154.32,101.39 173.89,101.39 174.12,101.16 v174.35,101.16
  Bottom 0.2: v149.53,99.5 152.43,99.5 v152.95,100.02 | v174.35,101.16 178.28,101.16 v178.62,101.5
CC2  (via drill 0.15)
  Top 0.2: USBC.B5 175.61,105.74 176.46,104.89 176.46,101.85 176.29,101.68 153.56,101.68 v153,101.12 | v149.66,100.35 147.28,97.97 PI1.95
  Bottom 0.2: v153,101.12 152.23,100.35 v149.66,100.35
DAC_!CLR
  Bottom 0.2: CON2.17 50.77,39.48 47.05,39.48 39.24,47.29 21.48,47.29 16.4,52.37 16.01,52.37 15.03,53.34 15.03,54.91 14.06,55.88 X1.B13
DAC_!LDAC
  Top 0.2: CON2.19 50.77,36.94 49.59,36.94 39.64,46.9 21.87,46.9 16.4,52.37 15.03,52.37 14.06,53.34 X1.B12
DIO_EN
  Top 0.2: CON3.29 50.77,76.19 50.77,75.02 41.2,65.45 41.2,52.66 39.44,50.9 X3.A11
DIO_LEVEL_SELECT
  Top 0.2: CON3.25 50.77,81.26 50.77,80.09 40.42,69.74 40.42,56.95 39.44,55.98 X3.A13
DIO_RESET
  Top 0.2: X3.A12 40.81,54.81 40.81,67.6 50.77,77.55 50.77,78.72 CON3.27
DPHY0_C_N  (1 unrouted)
DPHY0_C_P  (1 unrouted)
DPHY0_D0_N  (1 unrouted)
DPHY0_D0_P  (1 unrouted)
DPHY0_D1_N  (1 unrouted)
DPHY0_D1_P  (1 unrouted)
DPHY0_D2_N  (1 unrouted)
DPHY0_D2_P  (1 unrouted)
DPHY0_D3_N  (1 unrouted)
DPHY0_D3_P  (1 unrouted)
DPHY1_C_N  (1 unrouted)
DPHY1_C_P  (1 unrouted)
DPHY1_D0_N  (1 unrouted)
DPHY1_D0_P  (1 unrouted)
DPHY1_D1_N  (1 unrouted)
DPHY1_D1_P  (1 unrouted)
DPHY1_D2_N  (1 unrouted)
DPHY1_D2_P  (1 unrouted)
DPHY1_D3_N  (1 unrouted)
DPHY1_D3_P  (1 unrouted)
EEPROM_NWP
  Top 0.155: PI1.19 146.69,82.77 147.04,83.12 150.6,83.12 151.86,84.38 151.86,106.3 153.23,107.67 161.51,107.67 JP2.4
ETH_LEDG  (via drill 0.15)
  Top 0.155: PI1.18 141.13,82.37 140.47,81.71 137.27,81.71 135.71,80.14 134.71,80.14 v134.61,80.04 | v104.08,34.12 104.06,34.1 R8.1
  Bottom 0.155: v134.61,80.04 134.61,78.99 108.75,53.13 108.75,36.57 106.3,34.12 v104.08,34.12
ETH_LEDY  (via drill 0.15)
  Top 0.155: PI1.16 141.08,81.97 140.57,81.46 137.37,81.46 135.76,79.85 135.47,79.85 v135.13,79.52 | v114.51,34.12 116.06,34.12 116.64,33.54 R9.2
  Bottom 0.155: v135.13,79.52 135.13,79.17 108.99,53.02 108.99,37.39 112.26,34.12 v114.51,34.12
GND  (via drill 0.15)  (1 unrouted)
  Top 0.152: PI1.108 109.65,80.33 PI1.107 | PI1.114 109.65,81.53 | PI1.120 109.65,82.73 | PI1.119 109.65,82.73 | 109.65,82.73 109.65,82.71 | PI1.113 109.65,81.53 | 109.65,81.53 | PI1.131 109.65,85.13 PI1.132 | PI1.126 109.65,83.93 109.65,83.81 110.96,83.81 PI1.125 | PI1.138 109.65,86.33 | PI1.143 109.65,87.53 | 109.65,87.53 | PI1.137 109.65,86.33 | 109.65,86.33 109.65,86.24 | PI1.156 109.65,89.93 109.65,89.89 110.12,89.89 110.12,89.9 110.96,89.9 PI1.155 | PI1.168 109.65,92.33 | 109.65,92.33 109.65,92.38 | PI1.162 109.65,91.13 | PI1.161 109.65,91.13 | 109.65,91.13 109.65,91.05 | PI1.167 109.65,92.33 | PI1.173 109.65,93.53 | PI1.179 109.65,94.73 | PI1.174 109.65,93.53 | 109.65,93.53 109.65,93.51 | PI1.180 109.65,94.73 | 109.65,94.73 109.65,94.67 | PI1.186 109.65,95.93 | PI1.185 109.65,95.93 | 109.65,95.93 109.65,95.9 | PI1.192 109.65,97.13 | PI1.191 109.65,97.13 | 109.65,97.13 109.65,97.19 | PI1.197 v109.65,98.33 109.65,98.24
  Top 0.155: IC1.2 131.11,16.74 C10.2 | 143.57,98.38 143.58,98.37 PI1.97 | SD1.VSS 127.14,2.27 v127.17,2.29 | v135.27,2.78 135.27,1.38 135.14,1.24 SD1.MT4
  Top 0.191: PI1.149 109.68,88.73 109.65,88.76
  Top 0.2: 83.16,107.99 HDMI2.2 | HDMI2.S1 81.03,107.98 83.15,107.98 83.16,107.99 | 83.16,107.99 84.42,107.99 | 84.42,107.99 85.56,107.99 | 85.56,107.99 86.75,107.99 | 86.75,107.99 89.19,107.99 | 89.19,107.99 91.03,107.99 91.03,107.98 HDMI2.S2 | HDMI2.17 89.16,107.96 89.19,107.99 | HDMI2.11 86.76,107.98 86.75,107.99 | HDMI2.8 85.56,107.99 | HDMI2.5 84.36,107.93 84.42,107.99 | PI1.2 143.57,79.17 PI1.1 | PI1.7 143.59,80.37 143.57,80.35 143.55,80.37 PI1.8 | PI1.14 143.57,81.57 PI1.13 | PI1.21 143.64,83.17 143.57,83.1 | PI1.24 143.52,83.57 143.57,83.62 | PI1.34 143.57,85.57 | PI1.31 143.63,85.17 143.57,85.11 | PI1.41 143.58,87.17 143.57,87.16 | PI1.44 143.54,87.57 143.57,87.6 | PI1.54 143.55,89.57 143.57,89.55 143.95,89.17 PI1.51 | PI1.60 143.55,90.77 143.57,90.79 143.59,90.77 PI1.59 | PI1.66 143.55,91.97 143.57,91.95 143.59,91.97 PI1.65 | PI1.72 143.55,93.17 143.57,93.15 | PI1.73 143.67,93.57 143.57,93.67 | PI1.198 v109.65,98.33 | JP2.13 JP2.11 JP2.9 JP2.7 JP2.5 JP2.3 JP2.1 172.73,111.63 USBC.S4 | USBC.S4 USBC.S2 | USBC.S1 USBC.S3 USBC.S4 | R1.2 180.82,103.92 C2.2 | C3.2 76.19,112.24 v77.07,112.24 | IC4.3 76.57,110.04 v77.77,110.04 | v77.17,107.64 77.2,107.67 77.2,107.98 | v81.07,28.44 81,28.51 R2.2 | v82.37,27.34 82.37,26.46 C5.2 | C11.2 102.27,32.84 v103.07,32.84 | v107.71,34.67 D2.8 | v107.7,31.94 D2.3 | v111,31.99 111,32.86 D1.8 | v110.99,34.64 D1.3 | v131.3,17.81 131.27,17.78 C10.2 132.16,16.9 v132.23,16.97 | v133.37,11.94 v133.37,11.93 133.39,11.91 | v134.37,11.94 134.4,11.91 134.42,11.91 | v135.27,9.64 v135.28,9.63 135.28,9.55 | v135.27,8.44 v135.28,8.43 135.28,8.4 | v135.27,5.94 v135.28,5.93 135.28,5.89 | v135.27,4.34 v135.28,4.33 135.28,4.24
  Top 0.2: v135.27,2.78 v135.28,2.78 | v143.87,16.34 IC3.3 | v148.47,22.34 148.47,21.61 | 148.47,21.61 v148.47,21.14 | 148.47,21.61 148.55,21.69 C19.2 | v148.47,19.94 148.47,19.38 | 148.47,19.38 v148.47,18.84 | C18.2 149.65,19.38 148.47,19.38 | v149.57,17.84 149.81,17.84 149.82,17.85 | 160.23,11.46 v160.23,11.91 160.21,11.93 v160.21,13 159.71,13.5 C15.2 | 160.23,11.46 v160.23,10.81 160.23,9.72 v160.25,9.7 160.25,9.1 | 160.25,9.1 v160.25,8.65 v160.26,8.64 160.26,7.67 160.25,7.66 v160.25,7.54 160.25,7.01 | 160.25,7.01 v160.25,6.49 v160.26,6.48 | C17.2 160.14,6.9 160.25,7.01 | C16.2 160.23,9.12 160.25,9.1 | C14.2 160.14,11.37 160.23,11.46 | v167.03,10.08 v167.04,10.07 167.65,10.07 | 167.65,10.07 v168,10.07 v168.01,10.06 168.46,10.06 | 168.46,10.06 168.94,10.06 | 168.94,10.06 v169.01,10.06 169.03,10.04 169.41,10.04 | 169.41,10.04 v169.97,10.04 | PCIE.S2 167.65,11.93 167.65,10.07 | PCIE.75 168.46,11.45 168.46,10.06 | PCIE.73 168.9,10.1 168.94,10.06 | PCIE.71 169.4,10.05 169.41,10.04 | PCIE.39 v177.4,9.96 v177.41,9.95 178.89,9.95 v178.9,9.96 | PCIE.33 v178.9,9.96 | v178.9,9.96 v178.91,9.95 180.39,9.95 v180.4,9.96 | PCIE.27 v180.4,9.96 | v180.4,9.96 v180.41,9.95 181.89,9.95 v181.9,9.96 | PCIE.21 v181.9,9.96 | v181.9,9.96 v181.91,9.95 183.39,9.95 v183.4,9.96 | PCIE.15 v183.4,9.96 | v183.4,9.96 v183.41,9.95 184.89,9.95 v184.9,9.96 | PCIE.9 v184.9,9.96 | v184.9,9.96 v184.91,9.95 186.39,9.95 v186.4,9.96 | PCIE.3 v186.4,9.96 | v186.4,9.96 v186.41,9.95 v187.91,9.95 188,10.04 PCIE.S1
  Top 0.203: HDMI1.S1 60.28,107.98 | 60.28,107.98 61.47,107.98 | 61.47,107.98 62.65,107.98 | 62.65,107.98 63.91,107.98 | 63.91,107.98 66.32,107.98 | 66.32,107.98 HDMI1.S2 | HDMI1.2 60.3,107.96 60.28,107.98 | HDMI1.5 61.5,107.95 61.47,107.98 | HDMI1.8 62.7,107.93 62.65,107.98 | HDMI1.11 63.9,107.97 63.91,107.98 | HDMI1.17 66.3,107.96 66.32,107.98 | USBC.A12 174.11,106.58 USBC.B1 | USBC.B12 USBC.A1 | IC5.4 151.58,15.55 151.55,15.52 | IC5.8 153.08,15.37 152.9,15.55
  Top 0.221: D2.8 D2.3 | D1.3 D1.8 | PCIE.S2 167.45,12.13 | 168.07,11.5 PCIE.75 PCIE.73 PCIE.71 | PCIE.3 186.65,11.5 PCIE.1 | PCIE.9 184.9,13.53 184.85,13.58 | PCIE.15 183.4,13.55 183.43,13.58 | PCIE.21 181.9,13.49 181.99,13.58 | PCIE.27 180.4,13.54 180.44,13.58 | PCIE.33 178.9,13.53 178.95,13.58 | PCIE.39 177.4,13.47 177.51,13.58 | PCIE.45 175.9,13.55 175.93,13.58 | PCIE.51 174.4,13.52 174.46,13.58 | PCIE.57 172.9,13.56 172.88,13.58
  Top 0.254: IC5.8 153.41,14.55 153.65,14.31 153.65,12.62 | 153.65,12.62 153.65,12.08 153.2,11.63 R11.2 | R13.2 153.67,12.64 153.65,12.62 | IC3.3 143.12,15.56 142.92,15.36 142.92,13.95 143,13.86 143,12.65 C9.2
  Top 0.305: C2.2 | v173.05,105.07 v173.04,105.08 173.04,105.18
  Top 0.406: C19.2 C18.2 149.78,17.81 | 149.78,17.81 149.78,15.79 150.05,15.52 151.55,15.52 152.3,15.52 IC5.9 152.9,15.55 | C20.2 149.82,17.85 149.78,17.81 | SD1.MT1 133.39,11.91 134.42,11.91 135.07,11.91 135.28,11.7 SD1.MT2 135.28,9.55 135.28,8.4 SD1.MT3 | SD1.MT3 135.28,5.89 135.28,4.24 v135.28,2.78 135.28,1.39 135.14,1.24 | SW1.3 138.59,7.25 | 138.59,7.25 SW1.1 | SD1.MT3 138.57,7.24 138.59,7.25 | C9.2 144.8,12.37 145.6,11.57 SW1.4 | R13.2 v154.57,11.57 v154.56,11.56 | v165.57,19.55 164.65,19.55 X2.2 164.56,19.97 163.89,20.64 C12.2 v164.87,21.09 v164.88,21.08 | C5.2 82.18,26.27 IC2.2 80.2,26.27 80.12,26.35 | C6.2 79.83,20.9 v79.81,20.92 79.81,26.04 80.12,26.35 | C7.2 59.94,20.48 v59.98,20.52 | C8.2 75.33,24.15 v75.3,24.18 | 75.76,22.45 75.5,22.45 v75.29,22.24 | R2.2 79.95,28.29 79.95,26.52 80.12,26.35 | C2.2 180.82,102.15 177.7,99.03 177.7,98.16 178.14,97.72 | 178.14,97.72 179.59,96.27 179.59,94.69 178.48,93.58 176.9,93.58 175.79,94.69 175.79,95.48 | 2280.1 177.69,96.81 178.14,97.26 178.14,97.72
  Top 0.508: C4.2 76.2,108.02 | 76.2,108.02 76.2,109.67 IC4.3 76.13,110.38 C3.2 | HDMI2.S1 77.2,107.98 76.24,107.98 76.2,108.02 | HDMI2.S4 80.94,108.08 81.03,107.98 | HDMI2.S3 HDMI2.S2 | HDMI1.S4 HDMI1.S1 | HDMI1.S3 HDMI1.S2
  Top 0.61: USBC.S1 181.12,106.58 USBC.A1 | USBC.S1 181.68,104.22 181.4,103.94 R1.2 | 174.11,106.58 173.6,106.58 USBC.S2 173.04,105.18 173.04,104.1 C1.2 | 187.85,13.27 187.85,12.43 PCIE.S1 | 186.65,11.5 186.65,13.56 186.63,13.58 | HDMI1.S3 69.69,113.24 76.12,113.24 | HDMI2.S4 80.17,113.24 76.12,113.24 | C3.2 76.13,113.23 76.12,113.24 | HDMI2.S3 100.25,112.48 JP3.2 | USBC.S1 186.38,107.14 C21.2
  Top 0.813: ETH1.MH4 ETH1.MH3 101.04,6.9 93.6,6.9 92.08,8.42 | C15.2 C14.2 158.95,9.14 C16.2 C17.2 | 143.57,98.38 143.57,93.67 143.57,93.15 143.57,91.95 143.57,90.79 143.57,89.55 143.57,87.6 143.57,87.16 143.57,85.57 143.57,85.11 143.57,83.62 143.57,83.1 143.57,81.57 143.57,80.35 143.57,79.17 v143.57,78.33 | 109.65,98.24 109.65,97.19 109.65,95.9 109.65,94.67 109.65,93.51 109.65,92.38 109.65,91.05 109.65,89.89 109.65,88.76 109.65,87.53 109.65,86.24 109.65,85.13 109.65,83.81 109.65,82.71 109.65,81.53 109.65,80.33 v109.65,78.63
  Top 1.27: PCIE.73 168.07,11.5 | 168.07,11.5 167.45,12.13 | 168.07,11.5 168.07,13 168.04,13.03 168.59,13.58 172.88,13.58 174.46,13.58 175.93,13.58 177.51,13.58 178.95,13.58 180.44,13.58 181.99,13.58 183.43,13.58 184.85,13.58 186.63,13.58 187.54,13.58 187.85,13.27 | X3.B14 X3.A14 | X3.B10 X3.A10 | X3.B15 X3.A15 | X3.B16 X3.A16 | X3.B25 X3.A25 | X3.B30 X3.A30 | X3.B31 X3.A31 | X3.B32 X3.A32 | X1.B32 X1.A32 | X1.B31 X1.A31 | X1.B30 X1.A30 | X1.B16 X1.A16 | X1.B15 X1.A15 | X1.B14 X1.A14 | X1.B10 X1.A10 | X1.B25 X1.A25
  Top 1.5: 2230.1 177.65,57.52 2242.1 177.69,75.52 2260.1 177.66,95.11 178.03,95.48 | 178.22,95.67 178.03,95.48 | 178.03,95.48 2280.1
  Bottom 0.155: v127.17,2.29 134.78,2.29 v135.27,2.78
  Bottom 0.406: v151.87,15.54 v151.88,15.55 v152.82,15.55
  other vias: 75.3,23.18 144.27,12.34
  pour Route15 (isolate 0.203): 200,-6 200,119 -5.8,119 -5.8,-6
  pour Route2 (isolate 0.203): 200.8,-5.6 200.8,119.4 -6.27,119.4 -6.27,-5.6
  pour Top (isolate 0.203): 200,-7.2 200,117.8 -6.89,117.8 -6.89,-7.2
  pour Bottom (isolate 0.203): 201.6,-5.6 201.6,119.4 -5.06,119.4 -5.06,-5.6
GPIO2  (via drill 0.15)
  Top 0.155: PI1.57 148.78,90.37 v149.04,90.63
  Top 0.2: CON3.24 53.4,83.9 67.26,83.9 GPIO.3
  Bottom 0.155: GPIO.3 67.31,82.95 68.47,81.79 68.47,81.02 69.53,79.95 70.37,79.95 72.45,77.87 72.45,74.64 73.5,73.59 114.16,73.59 130.9,90.33 132.51,90.33 133.21,91.02 134.8,91.02 135.05,91.27 139.59,91.27 140.91,89.95 148.36,89.95 v149.04,90.63
GPIO3  (via drill 0.15)
  Top 0.155: v149.63,90.17 149.58,90.13 146.86,90.13 146.68,89.95 144.92,89.95 PI1.55
  Bottom 0.155: GPIO.5 67.83,81.31 69.43,79.71 70.27,79.71 72.21,77.77 72.21,74.54 73.4,73.34 114.26,73.34 131,90.08 132.61,90.08 133.31,90.78 134.9,90.78 135.15,91.03 139.49,91.03 140.81,89.7 148.46,89.7 148.72,89.97 149.42,89.97 v149.63,90.17
  Bottom 0.2: CON3.22 53.4,86.34 62.28,86.34 67.26,81.36 GPIO.5
GPIO4  (via drill 0.15)
  Top 0.155: PI1.53 146.65,89.57 146.96,89.88 149.22,89.88 149.42,89.68 149.83,89.68 150.03,89.88 150.18,89.88 v150.28,89.78
  Top 0.2: v66.39,70.43 66.39,65.64 66.87,65.16 69.51,65.16 70.78,63.89 70.78,47.88 70.29,47.39 70.19,47.39 68.92,46.12 68.92,40.95 67.75,39.77 67.65,39.77 54.67,26.79 53.4,26.79 CON2.28 | v66.39,77.46 66.39,77.85 67.26,78.72 GPIO.7
  Bottom 0.155: GPIO.7 68.19,78.77 69.69,77.27 70.91,77.27 71.72,76.46 71.72,74.34 73.2,72.85 114.46,72.85 131.2,89.59 132.82,89.59 133.51,90.29 135.1,90.29 135.35,90.54 138.58,90.54 139.66,89.46 148.56,89.46 148.78,89.68 149.83,89.68 149.93,89.78 v150.28,89.78
  Bottom 0.2: v66.39,77.46 v66.39,70.43
GPIO5  (via drill 0.15)
  Top 0.155: PI1.33 149.88,85.57 v149.88,85.43
  Bottom 0.155: GPIO.29 68.78,49.36 70.21,49.36 71.89,47.68 82.06,47.68 103.3,68.92 116.15,68.92 132.37,85.14 138.83,85.14 139.25,85.57 149.74,85.57 v149.88,85.43
  Bottom 0.2: CON2.22 53.4,34.4 53.4,35.58 58.38,40.55 58.38,41.14 67.65,50.41 GPIO.29
GPIO6  (via drill 0.15)
  Top 0.155: PI1.29 146.01,84.77 146.43,85.19 149.13,85.19 149.39,84.93 150.4,84.93 v150.43,84.9
  Top 0.2: v58.67,70.91 53.4,76.19 CON3.30 | v58.67,61.25 58.67,56.95 67.26,48.36 GPIO.31
  Bottom 0.155: GPIO.31 68.41,47.19 82.28,47.19 103.52,68.44 116.35,68.44 132.5,84.58 139.89,84.58 140.56,85.25 149.08,85.25 149.4,84.93 150.4,84.93 v150.43,84.9
  Bottom 0.2: CON2.26 53.3,29.33 53.3,30.5 52.42,31.38 52.42,32.16 53.6,33.33 53.69,33.33 58.77,38.41 58.77,40.85 66.19,48.27 67.26,48.27 GPIO.31 | v58.67,61.25 v58.67,70.91
GPIO7  (via drill 0.15)
  Top 0.155: PI1.38 137.85,86.37 137.76,86.28 v137.27,86.28
  Bottom 0.155: GPIO.26 73.95,60.02 93.34,60.02 102.98,69.66 115.84,69.66 132.57,86.39 135.48,86.39 135.63,86.24 137.23,86.24 v137.27,86.28
  Bottom 0.2: CON3.4 53.3,109.18 53.3,108.01 51.74,106.45 51.74,103.81 50.47,102.55 50.37,102.55 48.72,100.89 48.72,66.81 51.06,64.47 51.16,64.47 52.42,63.2 52.42,63.1 58.67,56.86 68.92,56.86 69.8,55.98 GPIO.26
GPIO8  (via drill 0.15)
  Top 0.155: PI1.40 136.64,86.77 v136.64,86.81
  Top 0.2: v57.99,66.52 59.84,66.52 66.97,59.4 68.92,59.4 69.8,58.52 GPIO.24
  Bottom 0.155: GPIO.24 70.5,59.1 70.5,59.86 70.9,60.26 93.24,60.26 102.88,69.9 115.74,69.9 132.47,86.63 135.22,86.63 135.4,86.81 v136.64,86.81
  Bottom 0.2: v57.99,66.52 54.96,69.55 53.6,69.55 52.42,70.72 52.42,70.82 51.16,72.09 51.06,72.09 49.89,73.26 49.89,94.44 50.37,94.93 50.47,94.93 51.74,96.2 51.74,96.3 52.91,97.47 53.01,97.47 54.28,98.74 54.28,104.5 53.4,105.38 53.4,106.65 CON3.6
GPIO9  (via drill 0.15)
  Top 0.155: v149.56,87.13 149.39,86.96 145.84,86.96 145.65,86.77 PI1.39
  Top 0.2: v53.4,67.21 59.75,67.21 65.9,61.05 67.26,61.05 GPIO.21
  Bottom 0.155: GPIO.21 68.76,60.99 69.53,60.22 70.17,60.22 70.69,60.75 93.04,60.75 102.68,70.39 115.54,70.39 132.27,87.12 134.94,87.12 135.41,87.58 137.39,87.58 138.1,86.88 149.31,86.88 v149.56,87.13
  Bottom 0.2: v53.4,67.21 52.42,68.18 52.42,68.28 51.16,69.55 51.06,69.55 49.5,71.11 49.5,96.59 50.37,97.47 50.47,97.47 52.03,99.03 53.3,99.03 CON3.12
GPIO10  (via drill 0.15)
  Top 0.155: v148.85,87.46 148.74,87.57 PI1.43
  Top 0.2: CON3.10 53.3,101.57 53.3,100.4 52.33,99.42 52.33,92.39 52.03,92.1 52.03,70.53 53.01,69.55 57.99,69.55 63.94,63.59 67.26,63.59 GPIO.19
  Bottom 0.155: GPIO.19 69.08,61.76 70.17,61.76 70.69,61.23 92.84,61.23 102.48,70.87 115.34,70.87 132.11,87.64 133.62,87.64 134.1,88.12 134.95,88.12 135.24,87.83 137.53,87.83 138.24,87.12 148.51,87.12 v148.85,87.46
GPIO11  (via drill 0.15)
  Top 0.155: v150.26,86.78 150.1,86.62 145.94,86.62 145.68,86.37 PI1.37
  Bottom 0.155: GPIO.23 68.84,59.98 70.27,59.98 70.8,60.5 93.14,60.5 102.78,70.14 115.64,70.14 132.37,86.87 135.04,86.87 135.51,87.34 137.25,87.34 137.97,86.62 150.1,86.62 v150.26,86.78
  Bottom 0.2: CON3.8 53.3,104.11 53.3,102.94 51.74,101.37 51.74,101.28 50.47,100.01 50.37,100.01 49.1,98.74 49.1,68.96 51.06,67.01 51.16,67.01 52.42,65.74 52.42,65.64 53.6,64.47 54.57,64.47 60.53,58.52 67.26,58.52 GPIO.23
GPIO12  (via drill 0.15)
  Top 0.155: v139.46,85.08 139.55,85.17 PI1.32
  Top 0.2: CON2.18 53.4,39.48 59.75,39.48 67.65,47.39 68.92,47.39 69.8,48.27 GPIO.32
  Bottom 0.155: GPIO.32 70.11,48.29 70.96,47.44 82.17,47.44 103.41,68.68 116.25,68.68 132.42,84.85 139.23,84.85 v139.46,85.08
GPIO13  (via drill 0.15)
  Top 0.155: PI1.27 148.53,84.37 v148.86,84.7
  Bottom 0.155: GPIO.33 68.51,46.95 82.38,46.95 103.58,68.15 116.41,68.15 132.6,84.34 140.04,84.34 140.71,85.01 148.55,85.01 v148.86,84.7
  Bottom 0.2: CON2.24 53.4,31.86 53.4,32.45 59.16,38.21 59.16,40.65 64.24,45.73 67.26,45.73 GPIO.33
GPIO14  (via drill 0.15)
  Top 0.155: PI1.56 139.99,89.97 139.65,90.31 v139.51,90.31
  Top 0.2: CON3.18 53.4,91.42 63.94,91.42 68.92,86.44 68.92,86.05 70.78,84.19 70.78,79.7 69.9,78.82 GPIO.8
  Bottom 0.155: GPIO.8 71.96,76.66 71.96,74.44 73.3,73.1 114.36,73.1 131.1,89.84 132.72,89.84 133.41,90.53 135,90.53 135.25,90.78 139.04,90.78 v139.51,90.31
GPIO15  (via drill 0.15)
  Top 0.155: PI1.52 140.31,89.17 139.72,89.77 138.4,89.77 v138.4,89.98
  Bottom 0.155: GPIO.10 69.85,75.86 73.1,72.61 114.56,72.61 131.3,89.35 132.92,89.35 133.61,90.05 135.2,90.05 135.45,90.29 137.75,90.29 138.07,89.98 v138.4,89.98
  Bottom 0.2: CON3.20 53.3,88.88 53.3,87.71 52.42,86.83 52.42,85.95 53.6,84.78 59.94,84.78 67.56,77.16 68.92,77.16 69.8,76.28 GPIO.10
GPIO16  (via drill 0.15)
  Top 0.155: v136.99,83.61 137.59,84.21 139.62,84.21 140.18,84.77 PI1.30
  Top 0.2: CON2.36 53.4,16.64 53.4,17.81 70.78,35.19 70.78,42.31 69.9,43.19 GPIO.36
  Bottom 0.155: GPIO.36 69.85,44.4 71.91,46.46 82.59,46.46 103.79,67.66 116.61,67.66 132.8,83.85 136.74,83.85 v136.99,83.61
GPIO17  (via drill 0.15)
  Top 0.155: PI1.49 148.78,88.77 v148.96,88.95
  Top 0.2: v71.17,66.03 71.17,34.99 58.48,22.3 58.48,20.35 53.4,15.27 53.4,14 CON2.38 | v64.14,70.91 64.53,70.91 67.26,73.65 GPIO.11
  Bottom 0.155: GPIO.11 68.1,72.9 71.95,72.9 72.74,72.11 114.79,72.11 131.54,88.86 133.12,88.86 133.81,89.56 135.41,89.56 135.65,89.81 136.46,89.81 137.6,88.67 148.68,88.67 v148.96,88.95
  Bottom 0.2: v71.17,66.03 69.51,67.69 66.87,67.69 64.14,70.43 v64.14,70.91
GPIO18  (via drill 0.15)
  Top 0.155: PI1.50 140.31,88.77 139.63,89.44 137.87,89.44 v137.54,89.77
  Top 0.2: CON2.40 53.4,11.46 53.4,12.73 58.87,18.2 58.87,20.35 72.24,33.72 78.49,33.72 79.08,34.31 79.08,65.64 71.07,73.65 69.9,73.65 GPIO.12
  Bottom 0.155: GPIO.12 71.58,73.69 72.91,72.36 114.67,72.36 131.19,88.89 131.22,88.89 131.44,89.11 133.02,89.11 133.71,89.8 135.3,89.8 135.55,90.05 137.26,90.05 v137.54,89.77
GPIO19  (via drill 0.15)
  Top 0.155: PI1.25 149.16,83.97 v149.6,84.41
  Bottom 0.155: GPIO.35 68.45,44.35 68.45,45.86 69.3,46.71 82.49,46.71 103.69,67.91 116.51,67.91 132.7,84.1 140.14,84.1 140.81,84.76 147.62,84.76 148.17,84.21 149.4,84.21 v149.6,84.41
  Bottom 0.2: CON2.30 53.4,24.25 53.4,25.42 66.39,38.41 66.39,42.31 67.26,43.19 GPIO.35
GPIO20  (via drill 0.15)
  Top 0.155: v137.79,83.61 138.15,83.97 139.72,83.97 140.12,84.37 PI1.28
  Top 0.2: CON2.32 53.4,21.71 53.4,22.88 68.92,38.41 68.92,39.77 69.8,40.65 GPIO.38
  Bottom 0.155: GPIO.38 70.71,41.53 70.71,44.9 72.02,46.22 82.69,46.22 103.89,67.41 116.73,67.41 132.93,83.61 136.29,83.61 136.79,83.11 137.19,83.11 137.69,83.61 v137.79,83.61
GPIO21  (via drill 0.15)
  Top 0.155: v135.99,82.87 137.79,82.87 138.64,83.72 139.82,83.72 140.07,83.97 PI1.26
  Top 0.2: CON2.34 53.4,19.17 53.4,20.35 69.8,36.75 69.8,38.11 GPIO.40
  Bottom 0.155: GPIO.40 71.25,39.53 71.25,42.38 71.67,42.8 71.67,45.15 72.2,45.68 82.86,45.68 104.08,66.89 116.9,66.89 133.13,83.12 135.64,83.12 135.89,82.87 v135.99,82.87
GPIO22  (via drill 0.15)
  Top 0.155: PI1.45 150.22,87.97 v150.33,88.08
  Bottom 0.155: GPIO.15 68.5,69.8 70.66,69.8 72.48,71.62 115,71.62 131.54,88.16 131.56,88.16 131.78,88.38 133.32,88.38 134.02,89.07 135.61,89.07 135.85,89.32 136.26,89.32 137.5,88.08 v150.33,88.08
  Bottom 0.2: CON3.32 53.4,73.65 62.28,73.65 67.26,68.67 GPIO.15
GPIO23  (via drill 0.15)
  Top 0.155: PI1.48 140.34,88.37 139.84,88.88 136.06,88.88 v136.06,88.83
  Bottom 0.155: GPIO.16 72.61,71.37 115.12,71.37 131.88,88.13 133.42,88.13 134.12,88.83 v136.06,88.83
GPIO24  (via drill 0.15)
  Top 0.155: PI1.46 140.33,87.97 139.97,88.33 v135.47,88.33
  Bottom 0.155: GPIO.18 68.83,65.05 68.83,62.95 69.78,62 70.27,62 70.8,61.48 92.74,61.48 102.38,71.12 115.24,71.12 132.01,87.89 133.52,87.89 134,88.36 135.44,88.36 v135.47,88.33
  Bottom 0.2: CON3.14 53.3,96.49 53.3,95.32 52.03,94.05 52.03,73.65 53.6,72.09 59.94,72.09 66.97,65.06 68.83,65.06 68.83,65.05
GPIO25  (via drill 0.15)
  Top 0.155: PI1.42 139.5,87.17 139.32,87.35 134.8,87.35 v134.52,87.63
  Top 0.2: CON3.16 53.3,93.95 53.3,92.78 52.42,91.91 52.42,70.72 53.21,69.94 58.18,69.94 63.65,64.47 67.65,64.47 68.92,63.2 68.92,61.93 69.8,61.05 GPIO.22
  Bottom 0.155: GPIO.22 92.94,60.99 102.58,70.63 115.44,70.63 132.21,87.4 134.29,87.4 v134.52,87.63
GPIO26  (via drill 0.15)
  Top 0.155: PI1.23 149.8,83.57 v150.25,84.02
  Top 0.2: CON2.20 53.4,36.94 63.55,36.94 67.26,40.65 GPIO.37
  Bottom 0.155: GPIO.37 68.23,39.75 70.02,39.75 70.95,40.69 70.95,44.8 72.12,45.97 82.81,45.97 104.01,67.17 116.83,67.17 133.03,83.36 136.19,83.36 136.69,82.87 137.75,82.87 138.73,83.85 150.09,83.85 v150.25,84.02
GPIO27  (via drill 0.15)
  Top 0.155: PI1.47 149.42,88.37 v149.65,88.6
  Top 0.2: CON3.34 53.4,71.11 57.6,71.11 58.48,70.23 65.31,70.23 66.19,71.11 67.26,71.11 GPIO.13
  Bottom 0.155: GPIO.13 68.41,72.25 72.19,72.25 72.58,71.86 114.88,71.86 131.64,88.62 133.22,88.62 133.92,89.31 135.5,89.31 135.75,89.56 136.36,89.56 137.5,88.43 149.47,88.43 v149.65,88.6
GPIO_VREF  (via drill 0.15)
  Top 0.2: R6.2 155.63,92.09 155.41,91.87 | 155.41,91.87 153.96,91.87 v153.88,91.79 | v150.83,91.88 148.91,91.88 148.65,92.14 148.65,93.53 147.81,94.37 PI1.77 | 155.41,91.87 159.5,87.78 160.72,87.78 161.62,86.88 R4.1 R3.1 161.57,83.61 161.08,83.12 161.08,80.97 TP-GREF.TP
  Top 0.508: R7.2 R6.2
  Bottom 0.2: v153.88,91.79 150.92,91.79 v150.83,91.88
HDMI0_CEC  (via drill 0.15)
  Top 0.2: PI1.152 98.82,89.13 v98.48,88.8 | v87.8,101.79 87.56,102.03 87.56,106.3 87.57,106.31 87.57,106.41 | 87.57,106.41 HDMI2.13 | HDMI2.13 87.56,106.42 87.57,106.41
  Bottom 0.2: v98.48,88.8 98.17,88.8 98.01,88.64 97.45,88.64 97,89.09 86.05,89.09 80.75,94.4 80.75,95.15 82.67,97.07 86.07,97.07 87.53,98.53 87.53,101.52 v87.8,101.79
HDMI0_CK_N  (via drill 0.15)
  Top 0.121: HDMI2.12 87.16,106.3 86.96,106.1 86.96,101.8 91.78,96.98 v91.97,97.17 | v115.58,96.94 115.58,96.69 111.45,96.69 111.42,96.73 PI1.189
  Bottom 0.121: v91.97,97.17 91.78,96.98 93.93,94.83 111.13,94.83 112.98,96.68 115.58,96.68 v115.58,96.94
HDMI0_CK_P  (via drill 0.15)
  Top 0.121: HDMI2.10 86.36,106.38 86.64,106.1 86.64,101.68 91.56,96.76 v91.37,96.57 | v115.58,96.1 115.58,96.36 110.99,96.36 PI1.187
  Bottom 0.121: v91.37,96.57 91.56,96.76 93.81,94.51 111.25,94.51 113.1,96.36 115.58,96.36 v115.58,96.1
HDMI0_D0_N  (via drill 0.15)
  Top 0.121: HDMI2.9 85.96,106.36 85.7,106.1 85.7,101.43 90.4,96.73 v90.59,96.92 | v116.54,95.77 116.54,95.49 111,95.49 PI1.183
  Bottom 0.121: v90.59,96.92 90.4,96.73 92.97,94.16 111.56,94.16 112.91,95.51 116.54,95.51 v116.54,95.77
HDMI0_D0_P  (via drill 0.15)
  Top 0.121: HDMI2.7 85.16,106.32 85.38,106.1 85.38,101.31 90.18,96.51 v89.99,96.32 | v116.54,94.91 116.54,95.16 110.99,95.16 PI1.181
  Bottom 0.121: v89.99,96.32 90.18,96.51 92.85,93.84 111.68,93.84 113.03,95.19 116.54,95.19 v116.54,94.91
HDMI0_D1_N  (via drill 0.15)
  Top 0.121: HDMI2.6 84.76,106.35 84.51,106.1 84.51,100.96 88.99,96.48 v89.18,96.67 | v117.32,94.55 117.32,94.29 111.52,94.29 | 111.52,94.29 111.42,94.29 | PI1.177 111.48,94.33 111.52,94.29
  Bottom 0.121: v89.18,96.67 88.99,96.48 91.94,93.53 111.9,93.53 112.66,94.29 117.32,94.29 v117.32,94.55
HDMI0_D1_P  (via drill 0.15)
  Top 0.121: HDMI2.4 83.96,106.33 84.19,106.1 84.19,100.84 88.77,96.26 v88.58,96.07 | v117.32,93.71 117.32,93.97 111,93.97 PI1.175
  Bottom 0.121: v88.58,96.07 88.77,96.26 91.82,93.21 112.02,93.21 112.78,93.97 117.32,93.97 v117.32,93.71
HDMI0_D2_N  (via drill 0.15)
  Top 0.121: HDMI2.3 83.56,106.28 83.31,106.03 83.31,100.52 87.61,96.22 v87.8,96.41 | v117.99,93.16 117.99,92.9 115.79,92.9 115.6,93.09 111,93.09 PI1.171
  Bottom 0.121: v87.8,96.41 87.61,96.22 90.93,92.9 117.99,92.9 v117.99,93.16
HDMI0_D2_P  (via drill 0.15)
  Top 0.121: HDMI2.1 82.76,106.26 82.99,106.03 82.99,100.4 87.39,96 v87.2,95.81 | v117.99,92.32 117.99,92.58 115.67,92.58 115.48,92.77 111,92.77 PI1.169
  Bottom 0.121: v87.2,95.81 87.39,96 90.81,92.58 117.99,92.58 v117.99,92.32
HDMI0_HOTPLUG  (via drill 0.15)
  Top 0.2: PI1.154 98.17,89.53 v97.8,89.16 | v90.22,101.37 89.96,101.63 HDMI2.19
  Bottom 0.2: v97.8,89.16 97.58,89.38 86.17,89.38 81.04,94.52 81.04,95.03 82.79,96.78 86.19,96.78 90.22,100.81 v90.22,101.37
HDMI0_SCL  (via drill 0.15)
  Top 0.2: HDMI2.15 88.36,101.99 90.81,99.55 v90.81,98.95 v90.8,98.94 | v92.57,99.27 92.82,99.02 110,99.02 110.29,98.73 PI1.199
  Bottom 0.2: v90.8,98.94 92.24,98.94 v92.57,99.27
HDMI0_SDA
  Top 0.2: PI1.200 92.03,98.73 88.76,102 HDMI2.16
HDMI1_CEC  (via drill 0.15)
  Top 0.2: PI1.150 99.44,88.73 v99.22,88.51
  Top 0.203: HDMI1.13 64.7,104.74 68.31,101.13 80.04,101.13 v80.43,101.52
  Bottom 0.2: v99.22,88.51 98.92,88.51 98.7,88.28 97.4,88.28 96.88,88.81 85.93,88.81 80.46,94.28 80.46,95.27 81.74,96.55 81.74,100.21 v80.43,101.52
HDMI1_CK_N  (via drill 0.15)
  Top 0.121: HDMI1.12 64.3,106.37 64.01,106.08 64.01,104.92 68.19,100.74 81.46,100.74 86.22,95.98 v86.41,96.17 | v117.21,91.98 117.21,91.72 115.35,91.72 115.18,91.89 111,91.89 PI1.165
  Bottom 0.121: v86.41,96.17 86.22,95.98 89.95,92.25 112.04,92.25 112.57,91.72 117.21,91.72 v117.21,91.98
HDMI1_CK_P  (via drill 0.15)
  Top 0.121: HDMI1.10 63.5,106.27 63.69,106.08 63.69,104.8 68.07,100.42 81.34,100.42 86,95.76 v85.81,95.57 | v117.21,91.14 117.21,91.4 115.23,91.4 115.07,91.56 110.99,91.56 PI1.163
  Bottom 0.121: v85.81,95.57 86,95.76 89.83,91.93 111.92,91.93 112.45,91.4 117.21,91.4 v117.21,91.14
HDMI1_D0_N  (via drill 0.15)
  Top 0.121: HDMI1.9 63.1,106.32 62.86,106.08 62.86,105.16 67.93,100.09 80.46,100.09 84.84,95.71 v85.03,95.9 | v116.4,90.82 116.4,90.54 115.23,90.54 115.04,90.73 PI1.159
  Bottom 0.121: v85.03,95.9 84.84,95.71 89.03,91.52 111.85,91.52 112.82,90.55 116.4,90.55 v116.4,90.82
HDMI1_D0_P  (via drill 0.15)
  Top 0.121: HDMI1.7 62.3,106.32 62.54,106.08 62.54,105.04 67.81,99.77 80.34,99.77 84.62,95.49 v84.43,95.3 | v116.44,89.93 v116.43,89.94 116.43,90.18 115.14,90.18 114.99,90.33 PI1.157
  Bottom 0.121: v84.43,95.3 84.62,95.49 88.91,91.2 111.73,91.2 112.75,90.18 116.44,90.18 v116.44,89.93
HDMI1_D1_N  (via drill 0.15)
  Top 0.121: HDMI1.6 61.9,106.3 61.66,106.06 61.66,105.46 67.68,99.44 79.45,99.44 83.46,95.43 v83.65,95.62 | v115.66,89.59 115.66,89.34 115.19,89.34 115,89.53 PI1.153
  Bottom 0.121: v83.65,95.62 83.46,95.43 88.1,90.79 111.52,90.79 112.78,89.53 114.98,89.53 115.18,89.33 115.66,89.33 v115.66,89.59
HDMI1_D1_P  (via drill 0.15)
  Top 0.121: HDMI1.4 61.1,106.3 61.34,106.06 61.34,105.34 67.56,99.12 79.33,99.12 83.24,95.21 v83.05,95.02 | v115.66,88.75 115.66,89.01 115.05,89.01 114.89,89.17 111,89.17 PI1.151
  Bottom 0.121: v83.05,95.02 83.24,95.21 87.98,90.47 111.4,90.47 112.7,89.17 114.88,89.17 115.05,89.01 115.66,89.01 v115.66,88.75
HDMI1_D2_N  (via drill 0.15)
  Top 0.121: HDMI1.3 60.7,106.29 60.46,106.05 60.46,105.51 67.26,98.71 78.53,98.71 82.06,95.18 v82.25,95.37 | v114.45,88.59 114.45,88.34 112.95,88.34 112.9,88.28 111.01,88.28 PI1.147
  Bottom 0.121: v82.25,95.37 82.06,95.18 87.19,90.05 111.14,90.05 112.84,88.35 114.45,88.35 v114.45,88.59
HDMI1_D2_P  (via drill 0.15)
  Top 0.121: HDMI1.1 59.9,106.29 60.14,106.05 60.14,105.39 67.14,98.39 78.41,98.39 81.84,94.96 v81.65,94.77 | v114.48,87.7 v114.47,87.71 114.47,88.01 113.06,88.01 112.98,87.93 PI1.145
  Bottom 0.121: v81.65,94.77 81.84,94.96 87.07,89.73 111.02,89.73 112.74,88.01 114.48,88.01 v114.48,87.7
HDMI1_HOTPLUG  (via drill 0.15)
  Top 0.2: v96.37,87.52 v96.38,87.53 100.17,87.53 100.39,87.3 100.82,87.3 101.05,87.53 PI1.144 | v78.01,102.31 77.7,102 68.67,102 67.1,103.57 HDMI1.19
  Bottom 0.2: v96.37,87.52 95.95,87.94 85.57,87.94 79.59,93.92 79.59,95.63 80.88,96.91 80.88,99.62 80.07,100.43 79.7,100.43 78.37,101.77 78.37,102.13 78.19,102.31 v78.01,102.31
HDMI1_SCL  (via drill 0.15)
  Top 0.2: PI1.148 100.08,88.33 v99.96,88.22 | v79.66,101.78 79.3,101.42 68.43,101.42 65.5,104.35 HDMI1.15
  Bottom 0.2: v99.96,88.22 99.66,88.22 99.43,87.99 97.28,87.99 96.76,88.52 85.81,88.52 80.17,94.16 80.17,95.39 81.45,96.67 81.45,100.09 80.53,101.01 80.22,101.01 79.92,101.31 79.92,101.62 79.76,101.78 v79.66,101.78
HDMI1_SDA  (via drill 0.15)
  Top 0.2: PI1.146 100.72,87.93 v100.61,87.82 | v78.88,101.98 78.61,101.71 68.55,101.71 65.9,104.36 HDMI1.16
  Bottom 0.2: v100.61,87.82 100.29,87.82 100.17,87.7 97.16,87.7 96.64,88.23 85.69,88.23 79.88,94.04 79.88,95.51 81.16,96.79 81.16,99.97 80.42,100.72 80,100.72 79.15,101.57 79.15,101.71 v78.88,101.98
HDMI_5V  (via drill 0.15)
  Top 0.2: HDMI1.18 66.7,105.71 v66.49,105.5 | v74.75,106.25 74.9,106.4 C4.1 | HDMI2.18 89.56,105.66 v89.38,105.48
  Top 0.508: IC4.2 74.9,108.46 C4.1
  Top 0.61: TP-5VHD.TP 77.87,106.25 v74.75,106.25